# EAGLE design controller (EAGLE 6.5.0)
AUTHOR: Robert Ou; REVISION: 1B

## Sheet 1 of 5
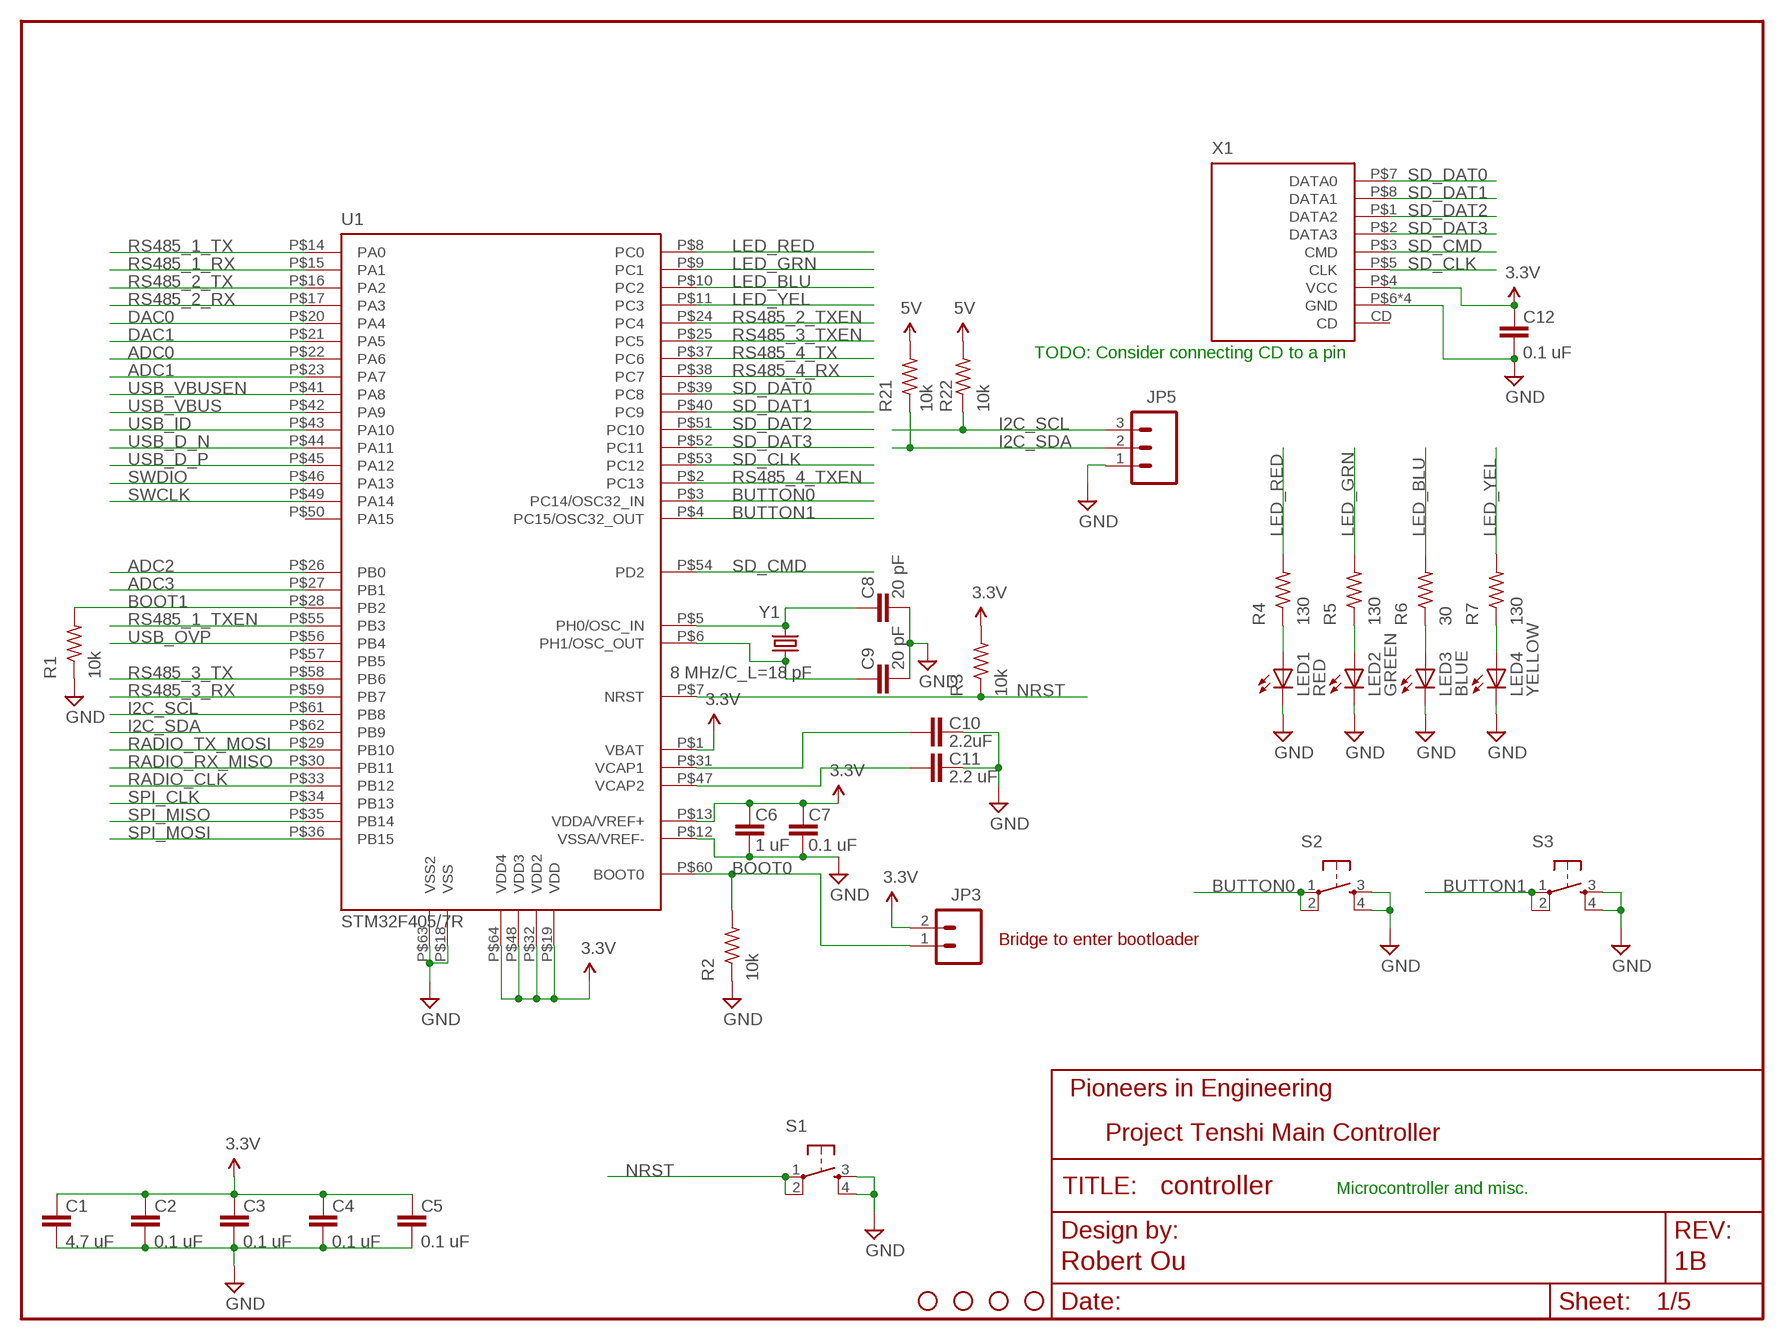
[diagram p0: schematic, sheet 1]

### Parts
C1  4.7 uF  CAP0805  [0805]
C2  0.1 uF  CAP0603-CAP  [0603-CAP]
C3  0.1 uF  CAP0603-CAP  [0603-CAP]
C4  0.1 uF  CAP0603-CAP  [0603-CAP]
C5  0.1 uF  CAP0603-CAP  [0603-CAP]
C6  1 uF  CAP0603-CAP  [0603-CAP]
C7  0.1 uF  CAP0603-CAP  [0603-CAP]
C8  20 pF  CAP0603-CAP  [0603-CAP]
C9  20 pF  CAP0603-CAP  [0603-CAP]
C10  2.2uF  CAP0603-CAP  [0603-CAP]
C11  2.2 uF  CAP0603-CAP  [0603-CAP]
C12  0.1 uF  CAP0603-CAP  [0603-CAP]
JP3  M02PTH  [1X02]
JP5  M031X03-MTA  [1X03-MTA]
LED1  RED  LED0805  [LED-0805]
LED2  GREEN  LED0805  [LED-0805]
LED3  BLUE  LED0805  [LED-0805]
LED4  YELLOW  LED0805  [LED-0805]
R1  10k  R-US_R0603  [R0603]
R2  10k  R-US_R0603  [R0603]
R3  10k  R-US_R0603  [R0603]
R4  130  R-US_R0603  [R0603]
R5  130  R-US_R0603  [R0603]
R6  30  R-US_R0603  [R0603]
R7  130  R-US_R0603  [R0603]
R21  10k  R-US_R0603  [R0603]
R22  10k  R-US_R0603  [R0603]
S1  TAC_SWITCHPTH  [TACTILE-PTH]
S2  TAC_SWITCHPTH  [TACTILE-PTH]
S3  TAC_SWITCHPTH  [TACTILE-PTH]
STANDOFF1  STAND-OFF  [STAND-OFF]
STANDOFF2  STAND-OFF  [STAND-OFF]
STANDOFF3  STAND-OFF  [STAND-OFF]
STANDOFF4  STAND-OFF  [STAND-OFF]
U1  STM32F405/7R  [QFP64]
X1  MICROSD-SOCKETAMPHENOL  [MICROSD-SOCKET]
Y1  8 MHz/C_L=18 pF  CRYSTALSMD  [HC49UP]

### Nets
3.3V: C1.1 C2.1 C3.1 C4.1 C5.1 C6.1 C7.1 C12.1 JP3.2 R3.2 U1.P$1(VBAT) U1.P$13(VDDA/VREF+) U1.P$19(VDD) U1.P$32(VDD2) U1.P$48(VDD3) U1.P$64(VDD4) X1.P$4(VCC) ; also sheet 3,4,5
5V: R21.2 R22.2 ; also sheet 2,3,5
ADC0: U1.P$22(PA6)
ADC1: U1.P$23(PA7)
ADC2: U1.P$26(PB0)
ADC3: U1.P$27(PB1)
BOOT0: JP3.1 R2.2 U1.P$60(BOOT0) ; also sheet 3
BOOT1: R1.2 U1.P$28(PB2)
BUTTON0: S2.1 S2.2 U1.P$3(PC14/OSC32_IN)
BUTTON1: S3.1 S3.2 U1.P$4(PC15/OSC32_OUT)
DAC0: U1.P$20(PA4)
DAC1: U1.P$21(PA5)
GND: C1.2 C2.2 C3.2 C4.2 C5.2 C6.2 C7.2 C8.2 C9.2 C10.2 C11.2 C12.2 JP5.1 LED1.C LED2.C LED3.C LED4.C R1.1 R2.1 S1.3 S1.4 S2.3 S2.4 S3.3 S3.4 U1.P$12(VSSA/VREF-) U1.P$18(VSS) U1.P$63(VSS2) X1.P$6(GND) X1.P$9(GND) X1.P$10(GND) X1.P$11(GND) ; also sheet 2,3,4,5
I2C_SCL: JP5.3 R22.1 U1.P$61(PB8)
I2C_SDA: JP5.2 R21.1 U1.P$62(PB9)
LED_BLU: R6.2 U1.P$10(PC2)
LED_GRN: R5.2 U1.P$9(PC1)
LED_RED: R4.2 U1.P$8(PC0)
LED_YEL: R7.2 U1.P$11(PC3)
N$2: C11.1 U1.P$47(VCAP2)
N$3: C10.1 U1.P$31(VCAP1)
N$4: C9.1 U1.P$6(PH1/OSC_OUT) Y1.1
N$5: LED1.A R4.1
N$6: C8.1 U1.P$5(PH0/OSC_IN) Y1.2
N$7: LED2.A R5.1
N$8: LED3.A R6.1
N$9: LED4.A R7.1
NRST: R3.1 S1.1 S1.2 U1.P$7(NRST) ; also sheet 3
RADIO_CLK: U1.P$33(PB12) ; also sheet 4
RADIO_RX_MISO: U1.P$30(PB11) ; also sheet 4
RADIO_TX_MOSI: U1.P$29(PB10) ; also sheet 4
RS485_1_RX: U1.P$15(PA1) ; also sheet 2
RS485_1_TX: U1.P$14(PA0) ; also sheet 2
RS485_1_TXEN: U1.P$55(PB3) ; also sheet 2
RS485_2_RX: U1.P$17(PA3) ; also sheet 2
RS485_2_TX: U1.P$16(PA2) ; also sheet 2
RS485_2_TXEN: U1.P$24(PC4) ; also sheet 2
RS485_3_RX: U1.P$59(PB7) ; also sheet 2
RS485_3_TX: U1.P$58(PB6) ; also sheet 2
RS485_3_TXEN: U1.P$25(PC5) ; also sheet 2
RS485_4_RX: U1.P$38(PC7) ; also sheet 2
RS485_4_TX: U1.P$37(PC6) ; also sheet 2
RS485_4_TXEN: U1.P$2(PC13) ; also sheet 2
SD_CLK: U1.P$53(PC12) X1.P$5(CLK)
SD_CMD: U1.P$54(PD2) X1.P$3(CMD)
SD_DAT0: U1.P$39(PC8) X1.P$7(DATA0)
SD_DAT1: U1.P$40(PC9) X1.P$8(DATA1)
SD_DAT2: U1.P$51(PC10) X1.P$1(DATA2)
SD_DAT3: U1.P$52(PC11) X1.P$2(DATA3)
SPI_CLK: U1.P$34(PB13)
SPI_MISO: U1.P$35(PB14)
SPI_MOSI: U1.P$36(PB15)
SWCLK: U1.P$49(PA14) ; also sheet 3
SWDIO: U1.P$46(PA13) ; also sheet 3
USB_D_N: U1.P$44(PA11) ; also sheet 3
USB_D_P: U1.P$45(PA12) ; also sheet 3
USB_ID: U1.P$43(PA10) ; also sheet 3
USB_OVP: U1.P$56(PB4) ; also sheet 3
USB_VBUS: U1.P$42(PA9) ; also sheet 3
USB_VBUSEN: U1.P$41(PA8) ; also sheet 3
Unconnected: U1.P$50(PA15) U1.P$57(PB5) X1.CD

### Notes on the sheet
- TODO: Consider connecting CD to a pin
- Bridge to enter bootloader
- Project Tenshi Main Controller
- Microcontroller and misc.

## Sheet 2 of 5
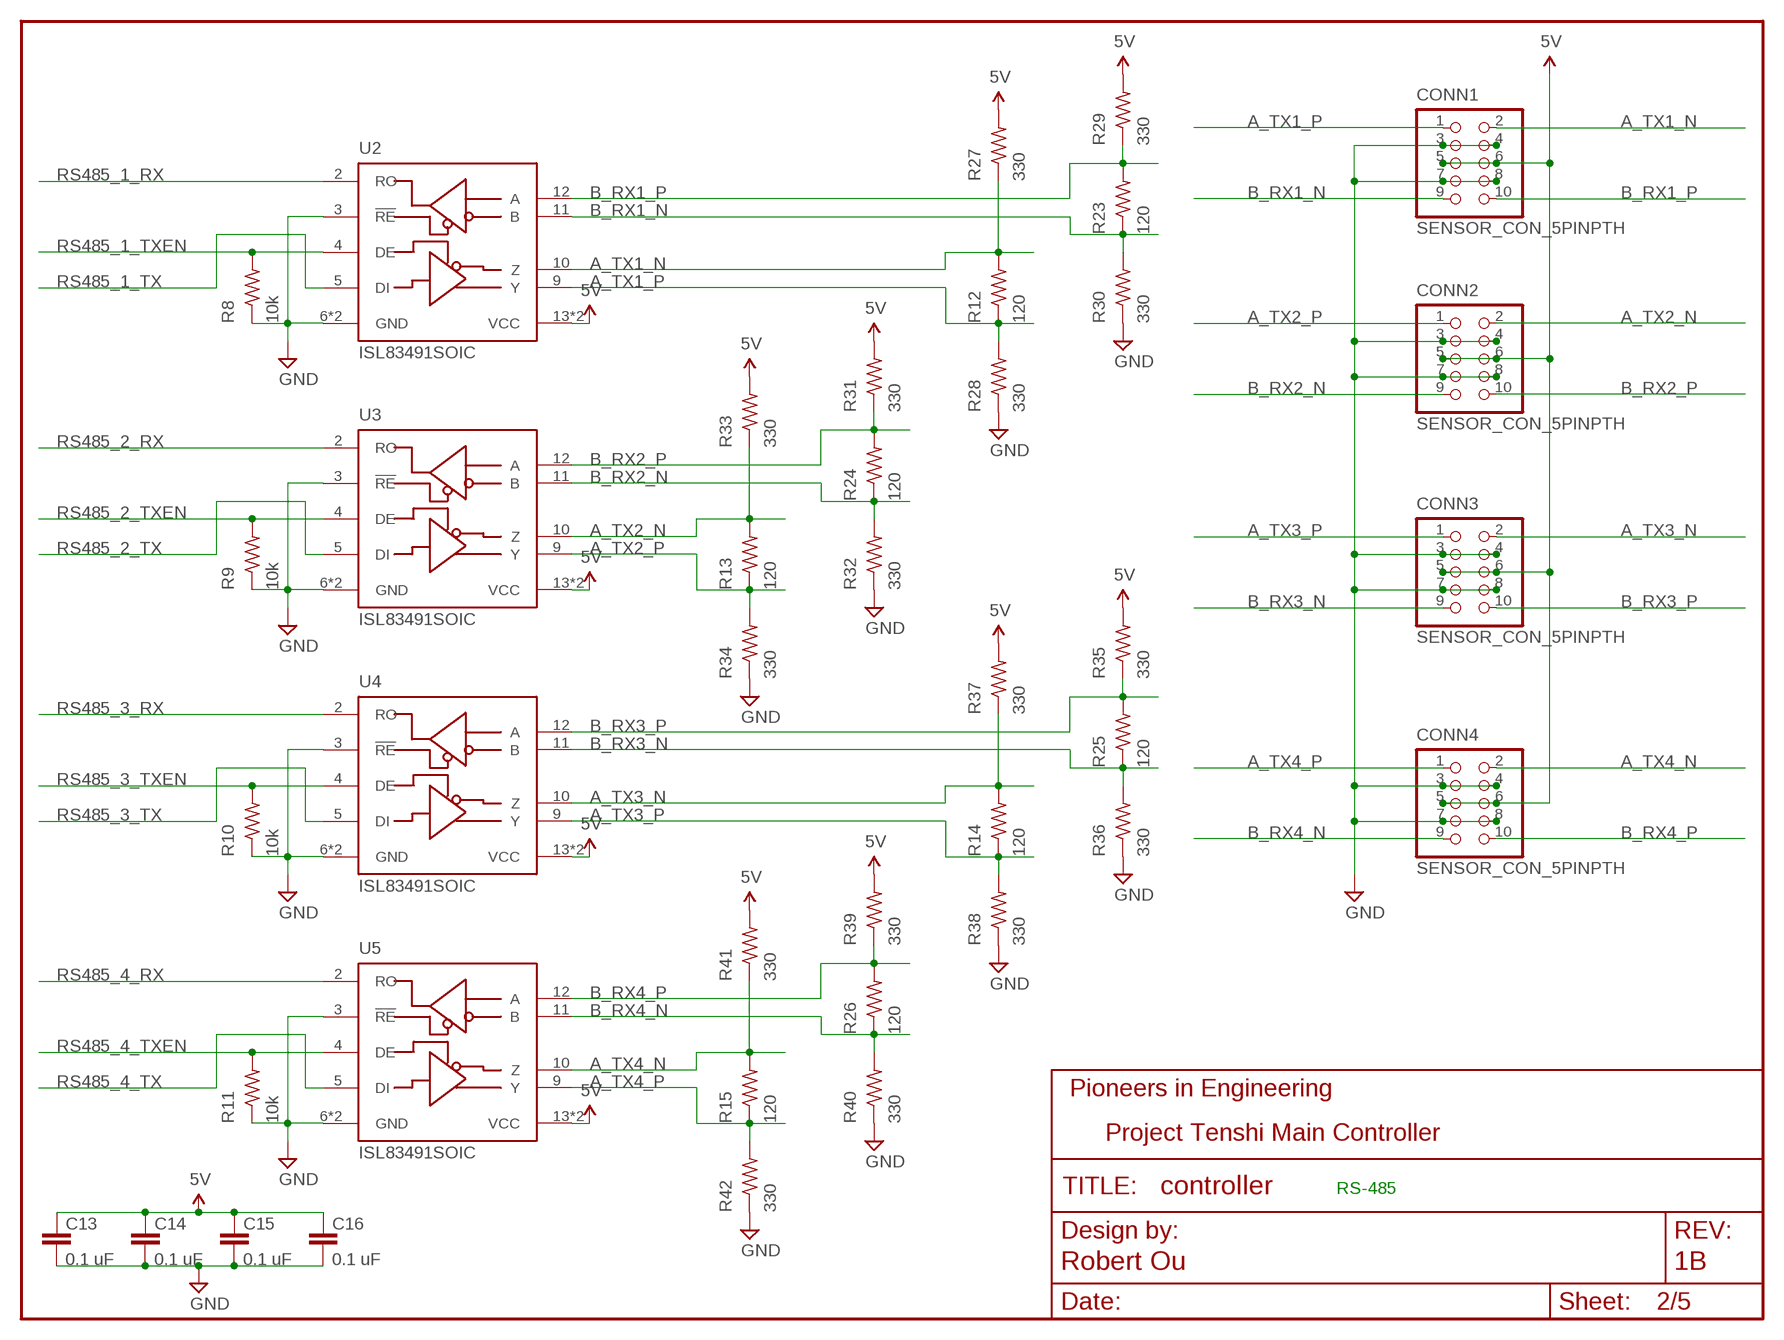
[diagram p1: schematic, sheet 2]

### Parts
C13  0.1 uF  CAP0603-CAP  [0603-CAP]
C14  0.1 uF  CAP0603-CAP  [0603-CAP]
C15  0.1 uF  CAP0603-CAP  [0603-CAP]
C16  0.1 uF  CAP0603-CAP  [0603-CAP]
CONN1  SENSOR_CON_5PINPTH  SENSOR_CON_5PINPTH-SHROUDED  [2X5_SHROUDED]
CONN2  SENSOR_CON_5PINPTH  SENSOR_CON_5PINPTH-SHROUDED  [2X5_SHROUDED]
CONN3  SENSOR_CON_5PINPTH  SENSOR_CON_5PINPTH-SHROUDED  [2X5_SHROUDED]
CONN4  SENSOR_CON_5PINPTH  SENSOR_CON_5PINPTH-SHROUDED  [2X5_SHROUDED]
R8  10k  R-US_R0603  [R0603]
R9  10k  R-US_R0603  [R0603]
R10  10k  R-US_R0603  [R0603]
R11  10k  R-US_R0603  [R0603]
R12  120  R-US_R0603  [R0603]
R13  120  R-US_R0603  [R0603]
R14  120  R-US_R0603  [R0603]
R15  120  R-US_R0603  [R0603]
R23  120  R-US_R0603  [R0603]
R24  120  R-US_R0603  [R0603]
R25  120  R-US_R0603  [R0603]
R26  120  R-US_R0603  [R0603]
R27  330  R-US_R0603  [R0603]
R28  330  R-US_R0603  [R0603]
R29  330  R-US_R0603  [R0603]
R30  330  R-US_R0603  [R0603]
R31  330  R-US_R0603  [R0603]
R32  330  R-US_R0603  [R0603]
R33  330  R-US_R0603  [R0603]
R34  330  R-US_R0603  [R0603]
R35  330  R-US_R0603  [R0603]
R36  330  R-US_R0603  [R0603]
R37  330  R-US_R0603  [R0603]
R38  330  R-US_R0603  [R0603]
R39  330  R-US_R0603  [R0603]
R40  330  R-US_R0603  [R0603]
R41  330  R-US_R0603  [R0603]
R42  330  R-US_R0603  [R0603]
U2  ISL83491SOIC  [SOIC14]
U3  ISL83491SOIC  [SOIC14]
U4  ISL83491SOIC  [SOIC14]
U5  ISL83491SOIC  [SOIC14]

### Nets
5V: C13.1 C14.1 C15.1 C16.1 CONN1.5 CONN1.6 CONN2.5 CONN2.6 CONN3.5 CONN3.6 CONN4.5 CONN4.6 R27.2 R29.2 R31.2 R33.2 R35.2 R37.2 R39.2 R41.2 U2.13(VCC) U2.14(VCC) U3.13(VCC) U3.14(VCC) U4.13(VCC) U4.14(VCC) U5.13(VCC) U5.14(VCC) ; also sheet 1,3,5
A_TX1_N: CONN1.2 R12.2 R27.1 U2.10(Z)
A_TX1_P: CONN1.1 R12.1 R28.2 U2.9(Y)
A_TX2_N: CONN2.2 R13.2 R33.1 U3.10(Z)
A_TX2_P: CONN2.1 R13.1 R34.2 U3.9(Y)
A_TX3_N: CONN3.2 R14.2 R37.1 U4.10(Z)
A_TX3_P: CONN3.1 R14.1 R38.2 U4.9(Y)
A_TX4_N: CONN4.2 R15.2 R41.1 U5.10(Z)
A_TX4_P: CONN4.1 R15.1 R42.2 U5.9(Y)
B_RX1_N: CONN1.9 R23.1 R30.2 U2.11(B)
B_RX1_P: CONN1.10 R23.2 R29.1 U2.12(A)
B_RX2_N: CONN2.9 R24.1 R32.2 U3.11(B)
B_RX2_P: CONN2.10 R24.2 R31.1 U3.12(A)
B_RX3_N: CONN3.9 R25.1 R36.2 U4.11(B)
B_RX3_P: CONN3.10 R25.2 R35.1 U4.12(A)
B_RX4_N: CONN4.9 R26.1 R40.2 U5.11(B)
B_RX4_P: CONN4.10 R26.2 R39.1 U5.12(A)
GND: C13.2 C14.2 C15.2 C16.2 CONN1.3 CONN1.4 CONN1.7 CONN1.8 CONN2.3 CONN2.4 CONN2.7 CONN2.8 CONN3.3 CONN3.4 CONN3.7 CONN3.8 CONN4.3 CONN4.4 CONN4.7 CONN4.8 R8.1 R9.1 R10.1 R11.1 R28.1 R30.1 R32.1 R34.1 R36.1 R38.1 R40.1 R42.1 U2.3(!RE) U2.6(GND) U2.7(GND) U3.3(!RE) U3.6(GND) U3.7(GND) U4.3(!RE) U4.6(GND) U4.7(GND) U5.3(!RE) U5.6(GND) U5.7(GND) ; also sheet 1,3,4,5
RS485_1_RX: U2.2(RO) ; also sheet 1
RS485_1_TX: U2.5(DI) ; also sheet 1
RS485_1_TXEN: R8.2 U2.4(DE) ; also sheet 1
RS485_2_RX: U3.2(RO) ; also sheet 1
RS485_2_TX: U3.5(DI) ; also sheet 1
RS485_2_TXEN: R9.2 U3.4(DE) ; also sheet 1
RS485_3_RX: U4.2(RO) ; also sheet 1
RS485_3_TX: U4.5(DI) ; also sheet 1
RS485_3_TXEN: R10.2 U4.4(DE) ; also sheet 1
RS485_4_RX: U5.2(RO) ; also sheet 1
RS485_4_TX: U5.5(DI) ; also sheet 1
RS485_4_TXEN: R11.2 U5.4(DE) ; also sheet 1

### Notes on the sheet
- Project Tenshi Main Controller
- RS-485

## Sheet 3 of 5
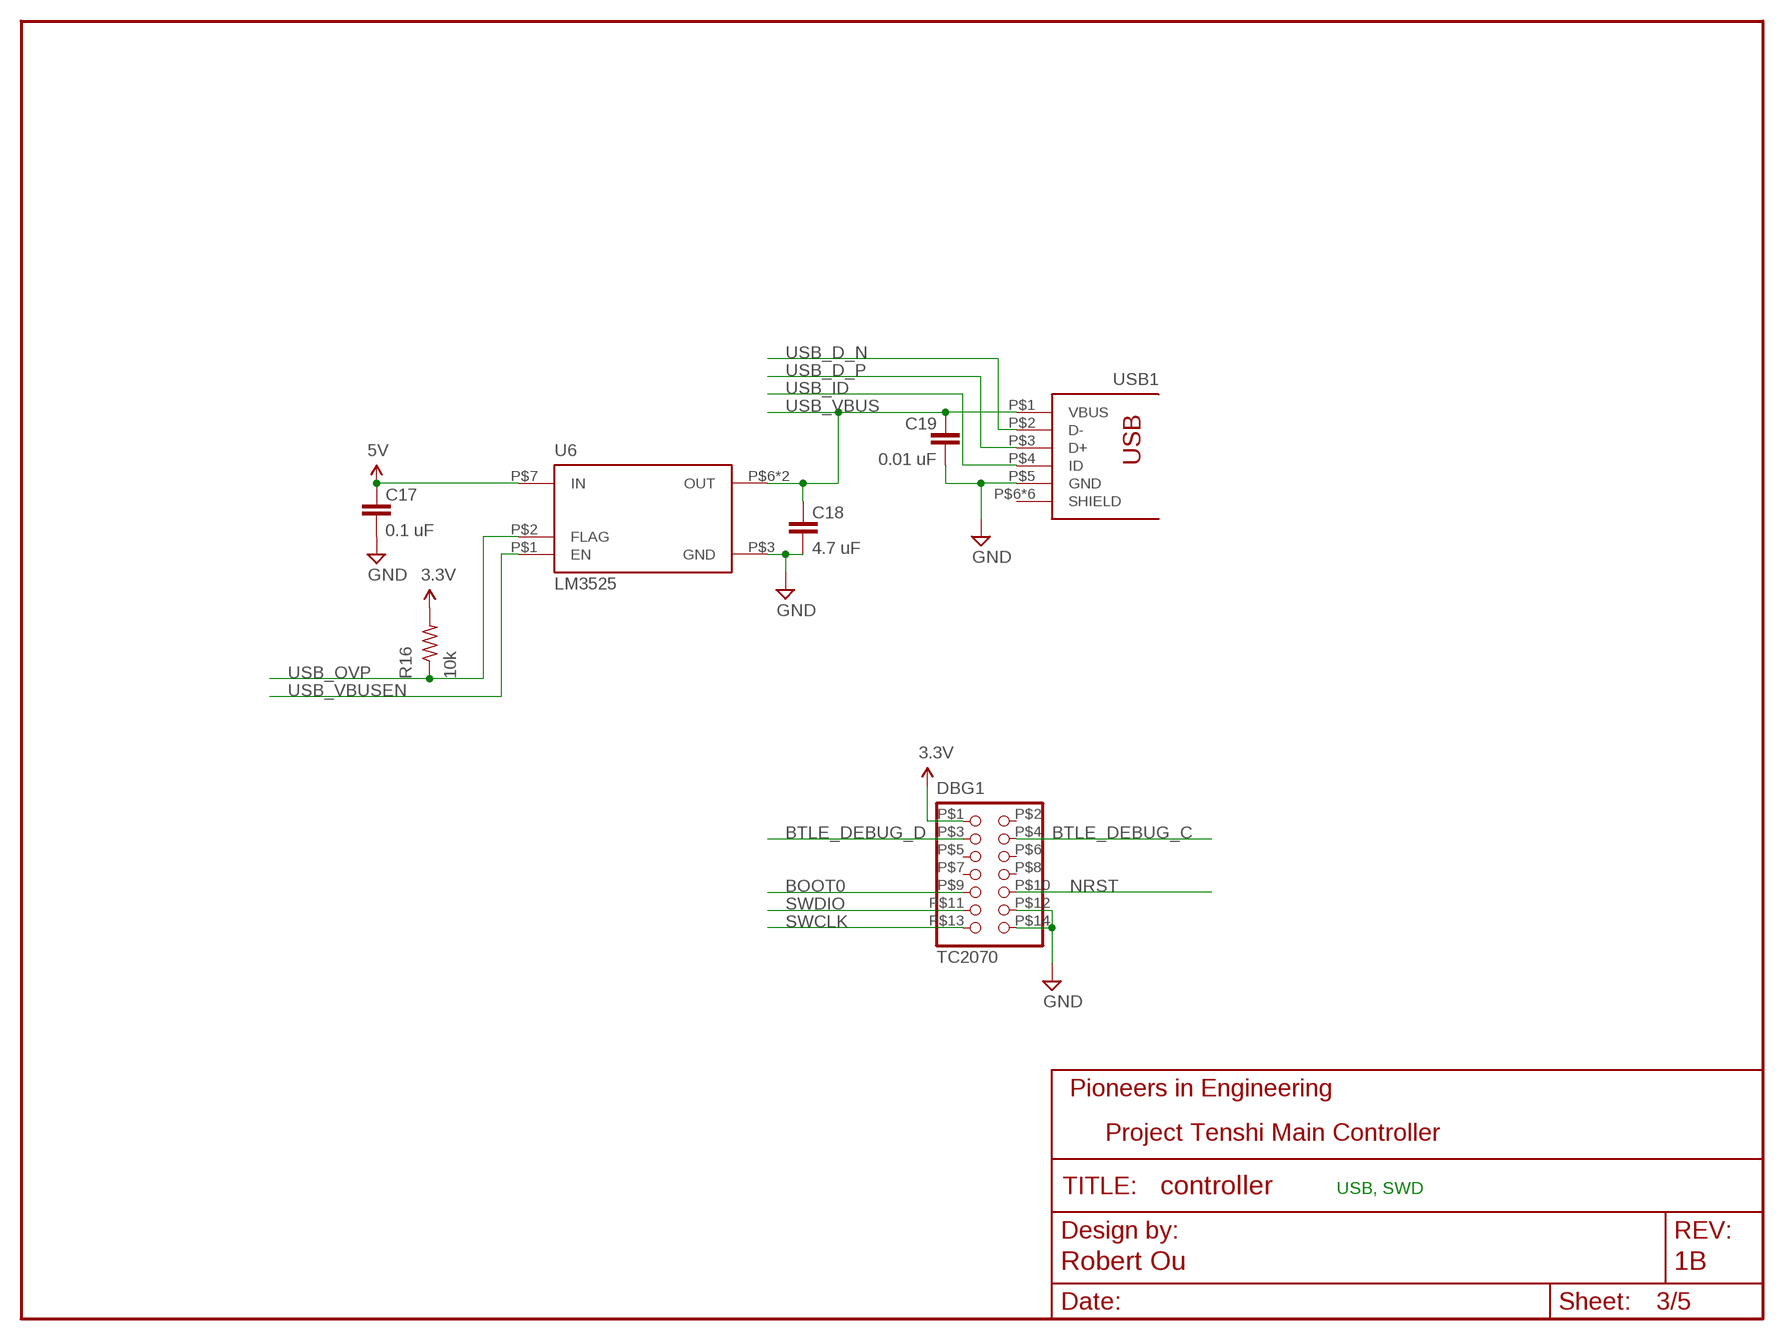
[diagram p2: schematic, sheet 3]

### Parts
C17  0.1 uF  CAP0603-CAP  [0603-CAP]
C18  4.7 uF  CAP0805  [0805]
C19  0.01 uF  CAP0603-CAP  [0603-CAP]
DBG1  TC2070  [TC2070]
R16  10k  R-US_R0603  [R0603]
U6  LM3525  [SOIC8]
USB1  USB-OTGMICRO-AB  [USB-MICRO-AB]

### Nets
3.3V: DBG1.P$1 R16.2 ; also sheet 1,4,5
5V: C17.1 U6.P$7(IN) ; also sheet 1,2,5
BOOT0: DBG1.P$9 ; also sheet 1
BTLE_DEBUG_C: DBG1.P$4 ; also sheet 4
BTLE_DEBUG_D: DBG1.P$3 ; also sheet 4
GND: C17.2 C18.2 C19.2 DBG1.P$12 DBG1.P$14 U6.P$3(GND) USB1.P$5(GND) ; also sheet 1,2,4,5
NRST: DBG1.P$10 ; also sheet 1
SWCLK: DBG1.P$13 ; also sheet 1
SWDIO: DBG1.P$11 ; also sheet 1
USB_D_N: USB1.P$2(D-) ; also sheet 1
USB_D_P: USB1.P$3(D+) ; also sheet 1
USB_ID: USB1.P$4(ID) ; also sheet 1
USB_OVP: R16.1 U6.P$2(FLAG) ; also sheet 1
USB_VBUS: C18.1 C19.1 U6.P$6(OUT) U6.P$8(OUT) USB1.P$1(VBUS) ; also sheet 1
USB_VBUSEN: U6.P$1(EN) ; also sheet 1
Unconnected: DBG1.P$2 DBG1.P$5 DBG1.P$6 DBG1.P$7 DBG1.P$8 USB1.P$6(SHIELD) USB1.P$7(SHIELD) USB1.P$8(SHIELD) USB1.P$9(SHIELD) USB1.P$10(SHIELD) USB1.P$11(SHIELD)

### Notes on the sheet
- Project Tenshi Main Controller
- USB, SWD

## Sheet 4 of 5
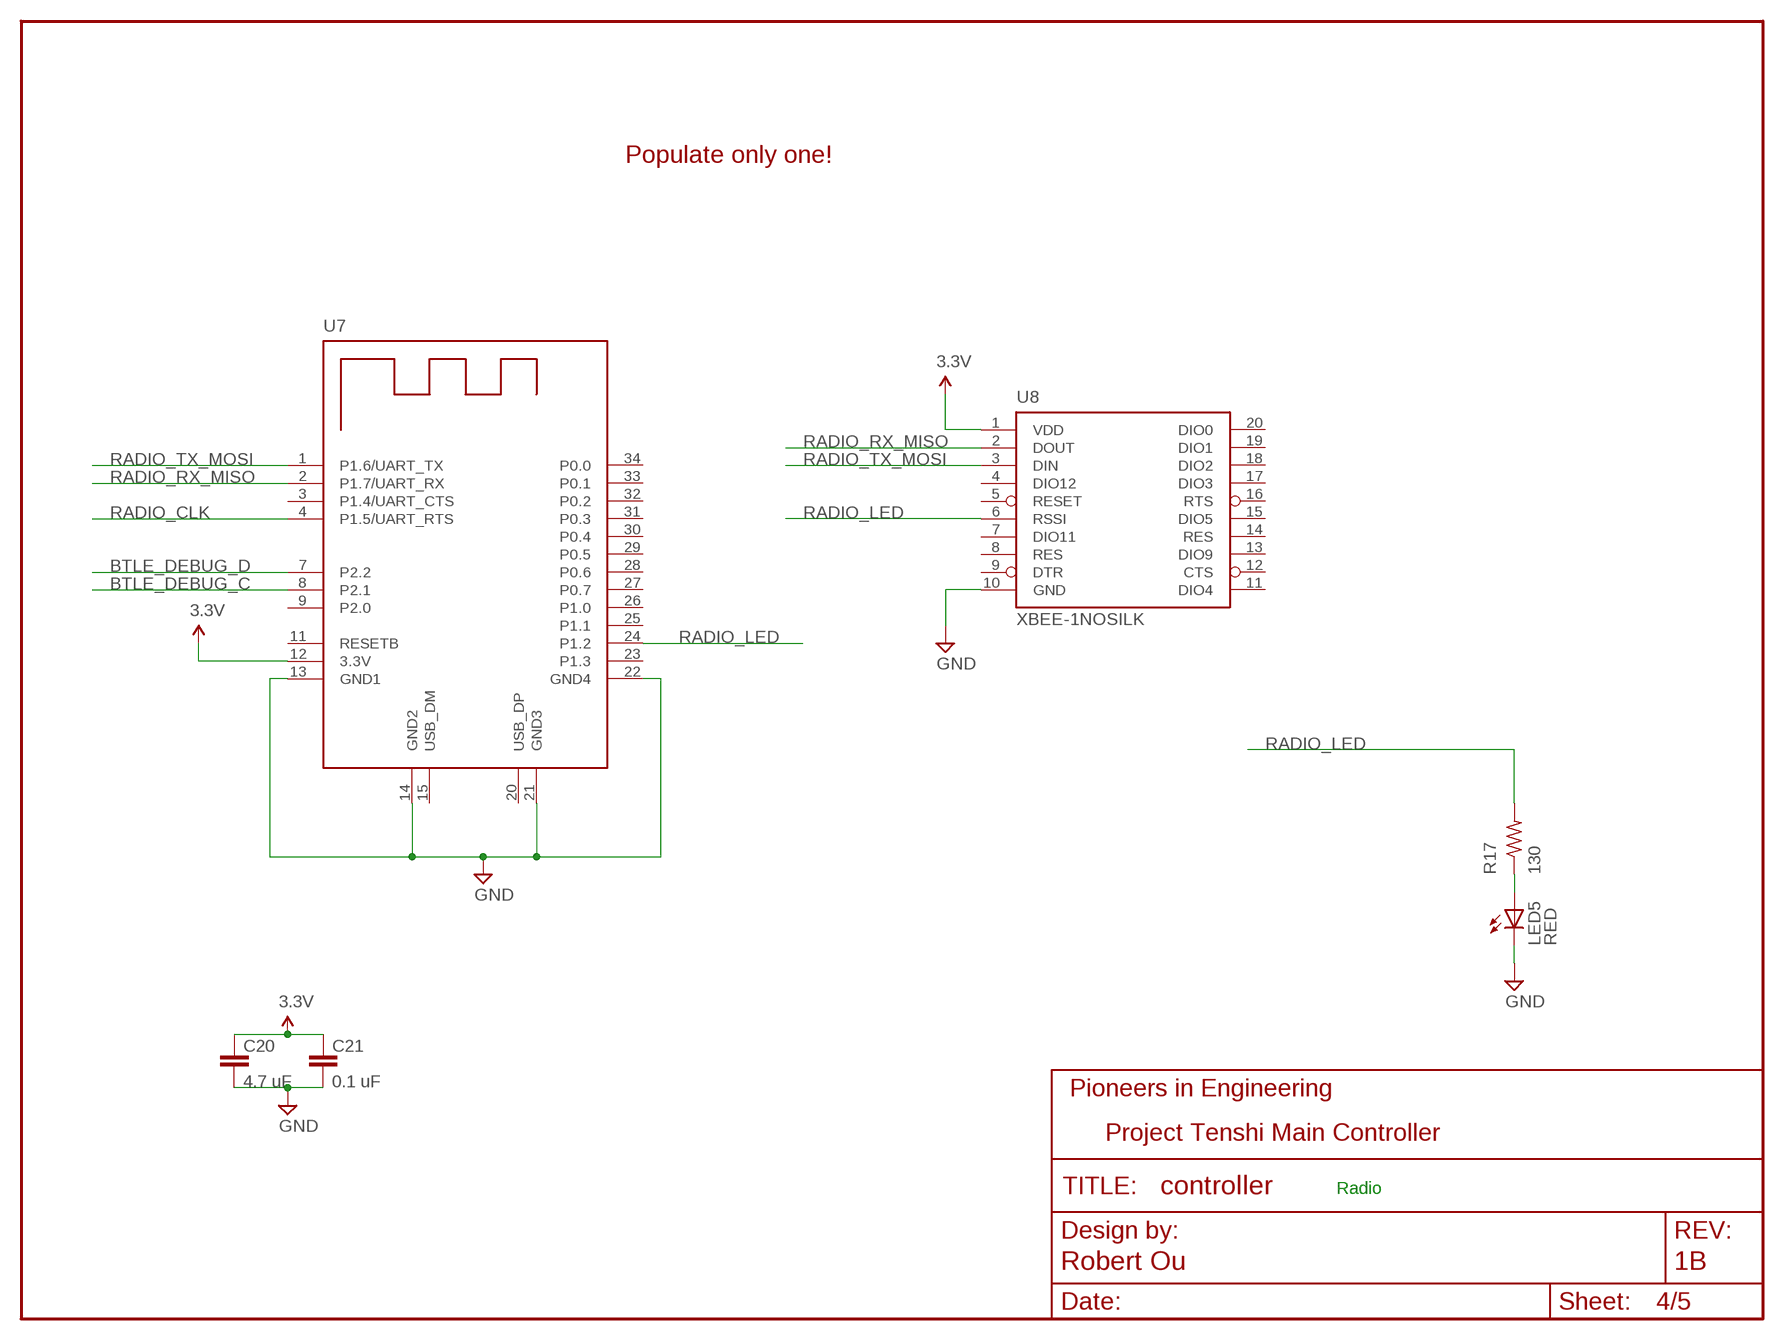
[diagram p3: schematic, sheet 4]

### Parts
C20  4.7 uF  CAP0805  [0805]
C21  0.1 uF  CAP0603-CAP  [0603-CAP]
LED5  RED  LED0805  [LED-0805]
R17  130  R-US_R0603  [R0603]
U7  BLE-HM-10  [BLE-HM-10]
U8  XBEE-1NOSILK  [XBEE-NOSILK]

### Nets
3.3V: C20.1 C21.1 U7.12(3.3V) U8.1(VDD) ; also sheet 1,3,5
BTLE_DEBUG_C: U7.8(P2.1) ; also sheet 3
BTLE_DEBUG_D: U7.7(P2.2) ; also sheet 3
GND: C20.2 C21.2 LED5.C U7.13(GND1) U7.14(GND2) U7.21(GND3) U7.22(GND4) U8.10(GND) ; also sheet 1,2,3,5
N$10: LED5.A R17.1
RADIO_CLK: U7.4(P1.5/UART_RTS) ; also sheet 1
RADIO_LED: R17.2 U7.24(P1.2) U8.6(RSSI)
RADIO_RX_MISO: U7.2(P1.7/UART_RX) U8.2(DOUT) ; also sheet 1
RADIO_TX_MOSI: U7.1(P1.6/UART_TX) U8.3(DIN) ; also sheet 1
Unconnected: U7.3(P1.4/UART_CTS) U7.9(P2.0) U7.11(RESETB) U7.15(USB_DM) U7.20(USB_DP) U7.23(P1.3) U7.25(P1.1) U7.26(P1.0) U7.27(P0.7) U7.28(P0.6) U7.29(P0.5) U7.30(P0.4) U7.31(P0.3) U7.32(P0.2) U7.33(P0.1) U7.34(P0.0) U8.4(DIO12) U8.5(RESET) U8.7(DIO11) U8.8(RES) U8.9(DTR) U8.11(DIO4) U8.12(CTS) U8.13(DIO9) U8.14(RES) U8.15(DIO5) U8.16(RTS) U8.17(DIO3) U8.18(DIO2) U8.19(DIO1) U8.20(DIO0)

### Notes on the sheet
- Populate only one!
- Project Tenshi Main Controller
- Radio

## Sheet 5 of 5
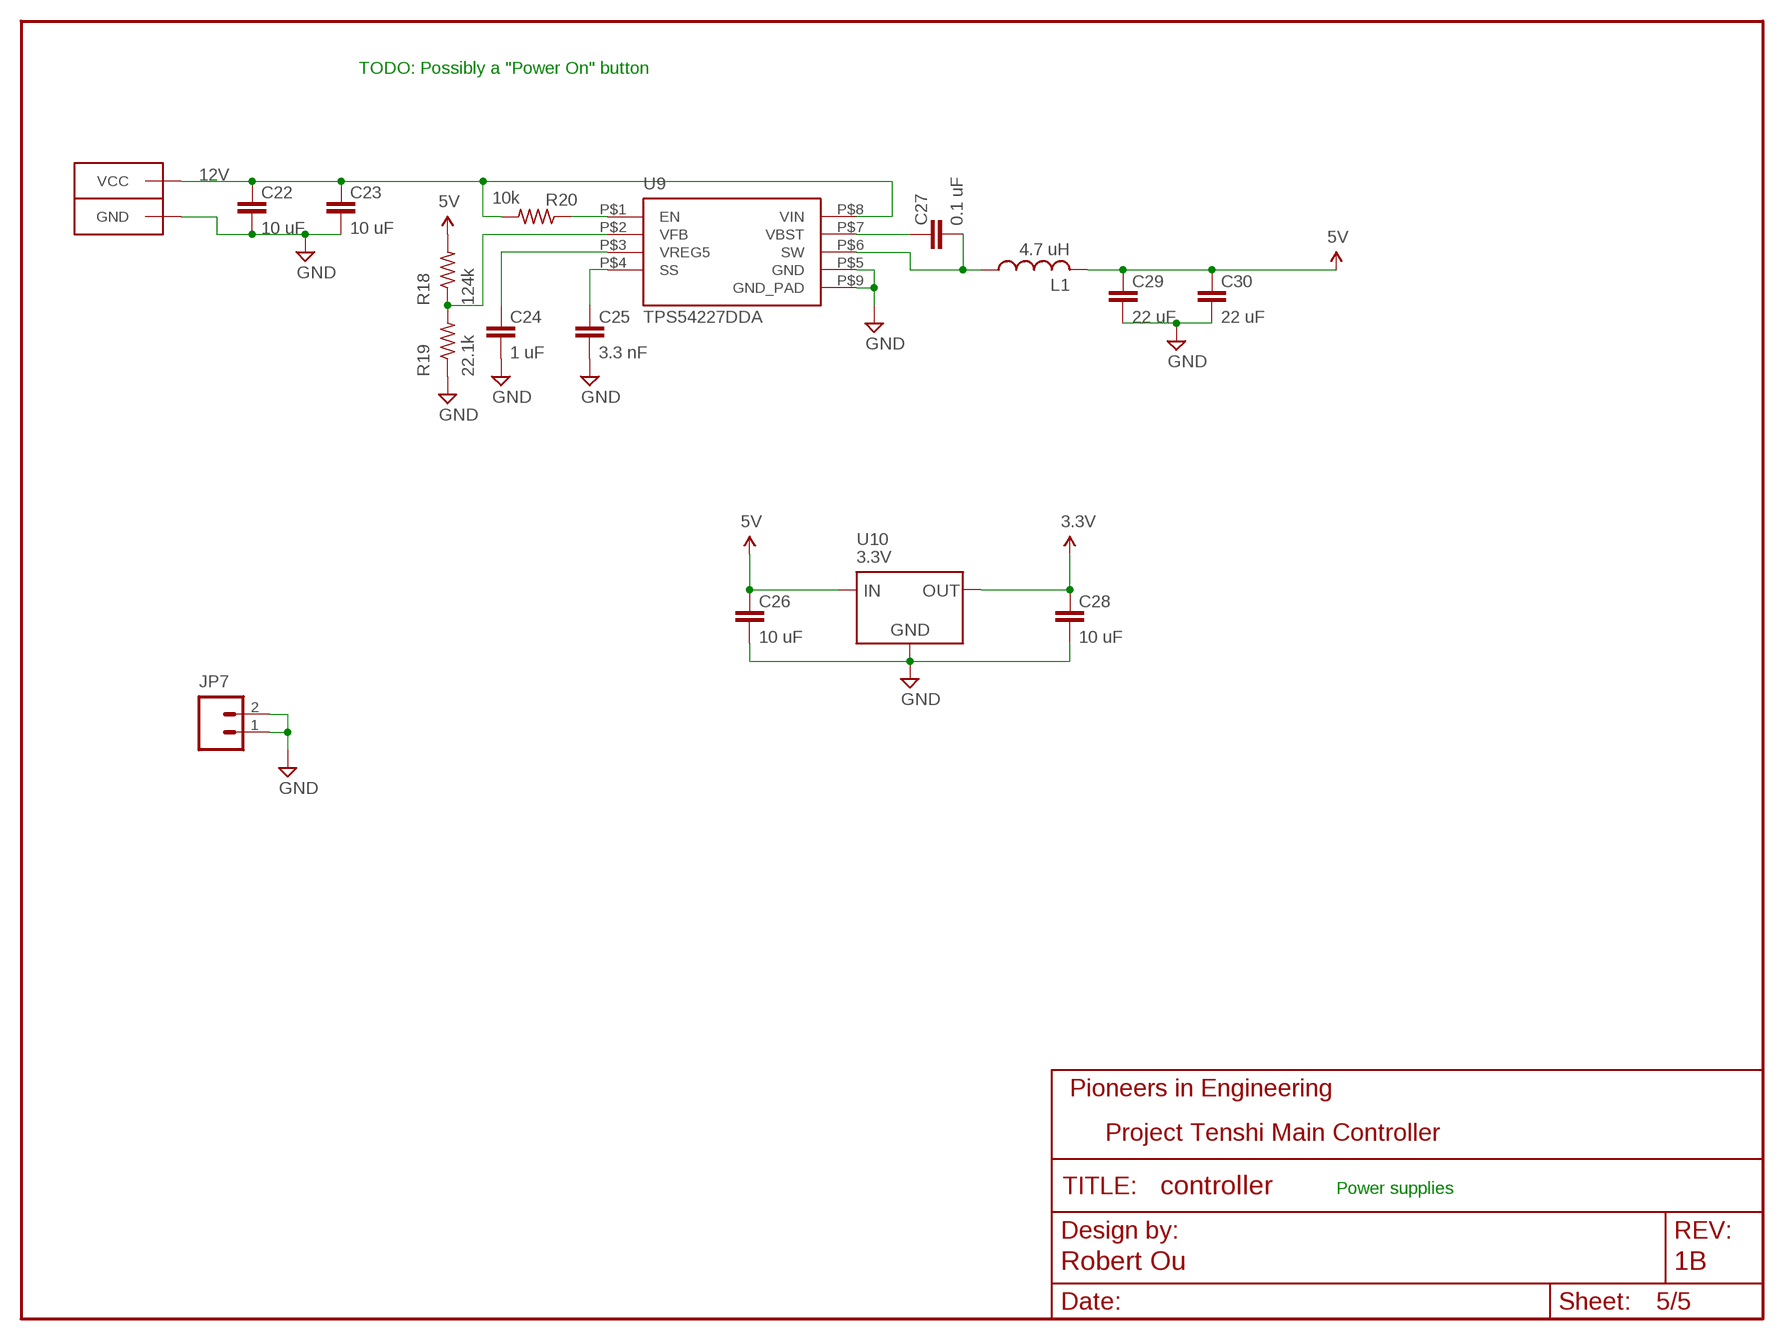
[diagram p4: schematic, sheet 5]

### Parts
C22  10 uF  CAP1206  [1206]
C23  10 uF  CAP1206  [1206]
C24  1 uF  CAP0603-CAP  [0603-CAP]
C25  3.3 nF  CAP0603-CAP  [0603-CAP]
C26  10 uF  CAP1206  [1206]
C27  0.1 uF  CAP0603-CAP  [0603-CAP]
C28  10 uF  CAP1206  [1206]
C29  22 uF  CAP1206  [1206]
C30  22 uF  CAP1206  [1206]
CONN5  ANDERSONHORIZONTAL  [ANDERSON_HORIZONTAL]
JP7  M02PTH  [1X02]
L1  4.7 uH  INDUCTOR6MM  [INDUCTOR-6MM]
R18  124k  R-US_R0603  [R0603]
R19  22.1k  R-US_R0603  [R0603]
R20  10k  R-US_R0603  [R0603]
U9  TPS54227DDA  [DDA]
U10  3.3V  LM1117  [SOT223]

### Nets
3.3V: C28.1 U10.P$2(OUT) U10.P$4(OUT) ; also sheet 1,3,4
5V: C26.1 C29.1 C30.1 L1.P$2 R18.2 U10.P$3(IN) ; also sheet 1,2,3
12V: C22.1 C23.1 CONN5.PIN2(VCC) R20.2 U9.P$8(VIN)
GND: C22.2 C23.2 C24.2 C25.2 C26.2 C28.2 C29.2 C30.2 CONN5.PIN1(GND) JP7.1 JP7.2 R19.1 U9.P$5(GND) U9.P$9(GND_PAD) U10.P$1(GND) ; also sheet 1,2,3,4
N$12: C27.1 U9.P$7(VBST)
N$13: C25.1 U9.P$4(SS)
N$14: C24.1 U9.P$3(VREG5)
N$15: R18.1 R19.2 U9.P$2(VFB)
N$16: R20.1 U9.P$1(EN)
N$17: C27.2 L1.P$1 U9.P$6(SW)

### Notes on the sheet
- TODO: Possibly a "Power On" button
- Project Tenshi Main Controller
- Power supplies

## Library data of the parts
C1-C30 = pie:CAP: Capacitor Standard 0603 ceramic capacitor, and 0.1" leaded capacitor.; PIE-INT-REF-NUM: CAPACITOR-GENERIC
CONN1-CONN4 = pie:SENSOR_CON_5PIN
CONN5 = pie:ANDERSON: 2-pin 25A Anderson Connector http://www.alliedelec.com/images/products/datasheets/bm/ANDERSON_POWER_PRODUCTS/70162018.pdf; PIE-INT-REF-NUM: Anderson
DBG1 = pie:TC2070; PIE-INT-REF-NUM: DNL
JP3 JP7 = pie:M02: 2-pin 0.1-inch header and MTA connector; PIE-INT-REF-NUM: BULK-STOCK
JP5 = pie:M03: 3-pin 0.1-inch header and MTA connector; PIE-INT-REF-NUM: MTA
L1 = pie:INDUCTOR: Inductor Standard inductor, American symbol; PIE-INT-REF-NUM: NR6028T4R7M
LED1-LED5 = pie:LED: LEDs Standard schematic elements and footprints for 5mm, 3mm, 1206, and 0603 sized LEDs. 5mm - Spark Fun Electronics SKU : COM-00529 (and others); PIE-INT-REF-NUM: LED
R1-R42 = pie:R-US_: RESISTOR, American symbol; PIE-INT-REF-NUM: RESISTOR-GENERIC
S1-S3 = pie:TAC_SWITCH: Momentary Switch Button commonly used for reset or general input. Spark Fun Electronics SKU : COM-00097; PIE-INT-REF-NUM: pth_pushbutton
STANDOFF1-STANDOFF4 = pie:STAND-OFF: #4 Stand Off This is the mechanical footprint for a #4 phillips button head screw. Use the keepout ring to avoid running the screw head into surrounding components. SKU : PRT-00447; PIE-INT-REF-NUM: DNL
U1 = pie:STM32F405/7R: STM32F405/407 - 64 pin; PIE-INT-REF-NUM: stm32f405
U2-U5 = pie:ISL83491; PIE-INT-REF-NUM: rs485_491
U6 = pie:LM3525: LM3525 Single Port USB Power Switch and Over-Current Protection; PIE-INT-REF-NUM: lm3525
U7 = pie:BLE-HM-10: HM-10 module CC2540-based BTLE module; PIE-INT-REF-NUM: hm10
U8 = pie:XBEE-1: XBee Header; PIE-INT-REF-NUM: xbee
U9 = pie:TPS54227: TPS54227 4.5V to 18V Input, 2-A SYNCHRONOUS STEP DOWN CONVERTER; PIE-INT-REF-NUM: tps54227
U10 = pie:LM1117; PIE-INT-REF-NUM: lm1117
USB1 = pie:USB-OTG: USB Connector OTG connector with ID pin; PIE-INT-REF-NUM: USB
X1 = pie:MICROSD-SOCKET: μSD socket Socket for a MicroSD/TransFlash card; PIE-INT-REF-NUM: uSD
Y1 = pie:CRYSTAL: Various standard crystals. Proven footprints. Spark Fun Electronics SKU : COM-00534; PIE-INT-REF-NUM: CRYSTAL

## Board
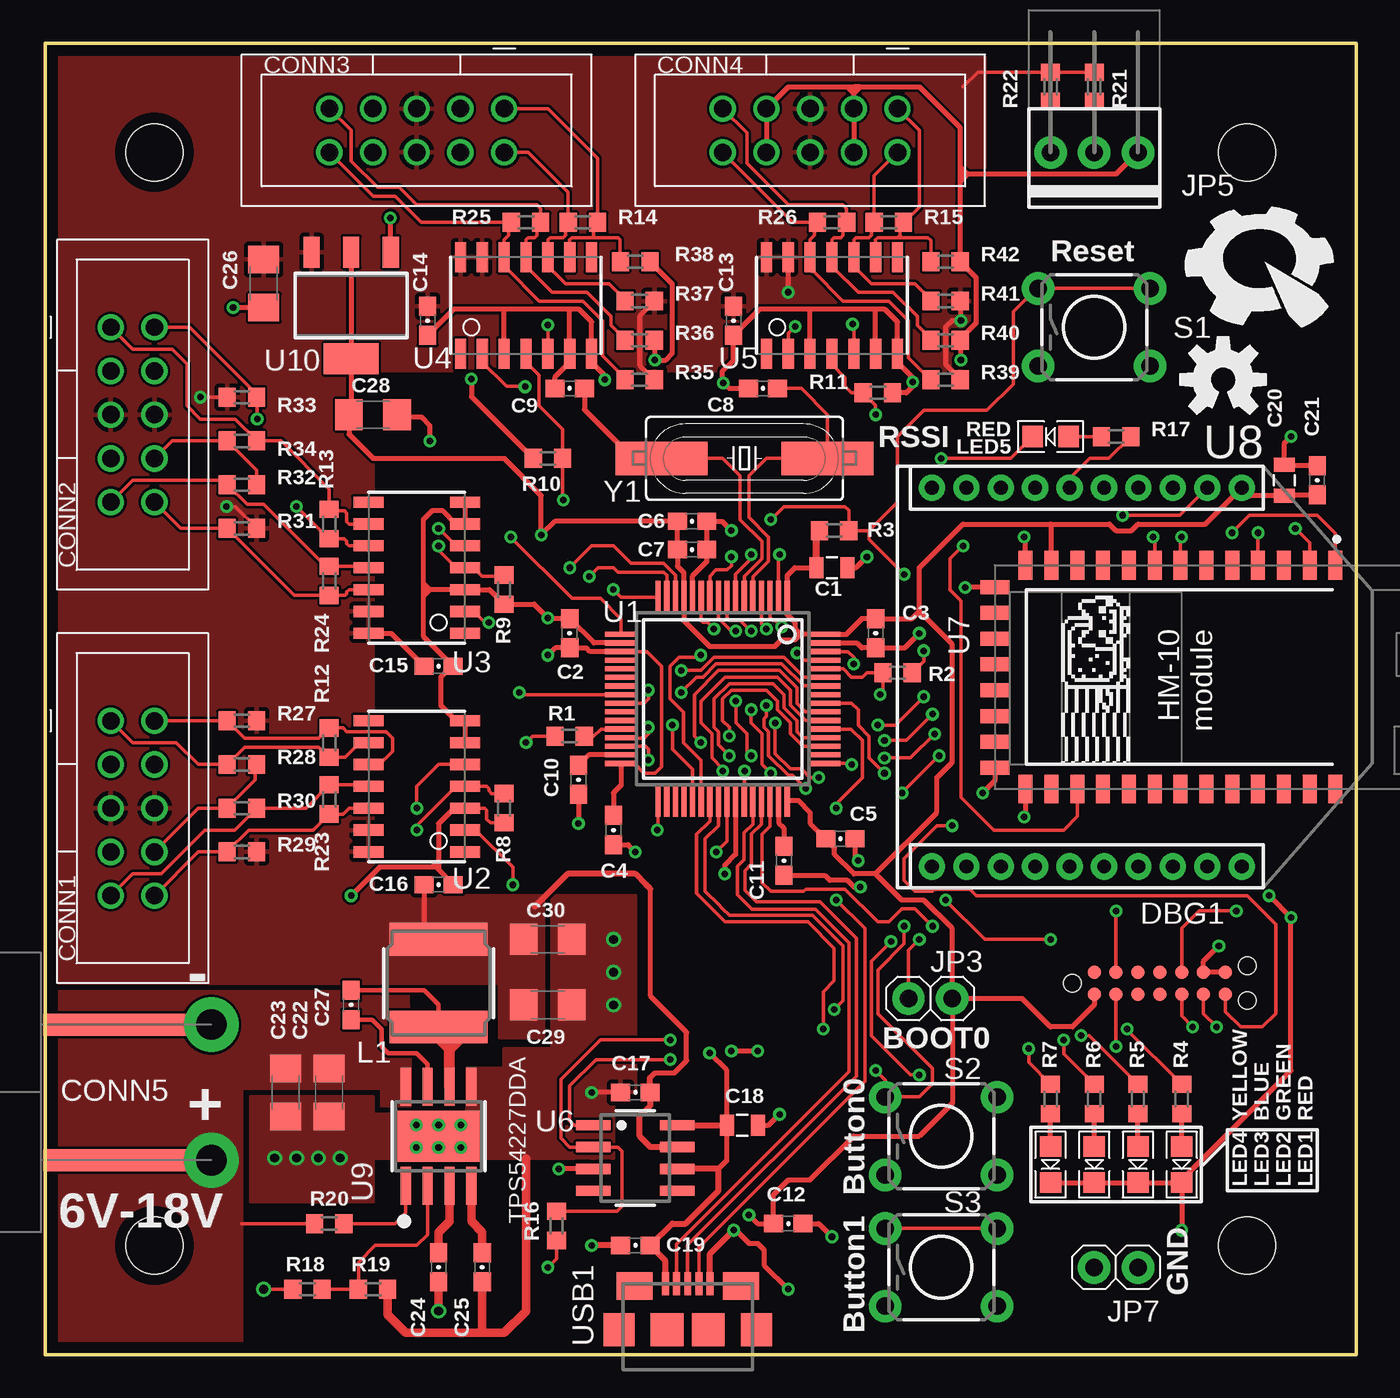
[diagram p5: board, top side]
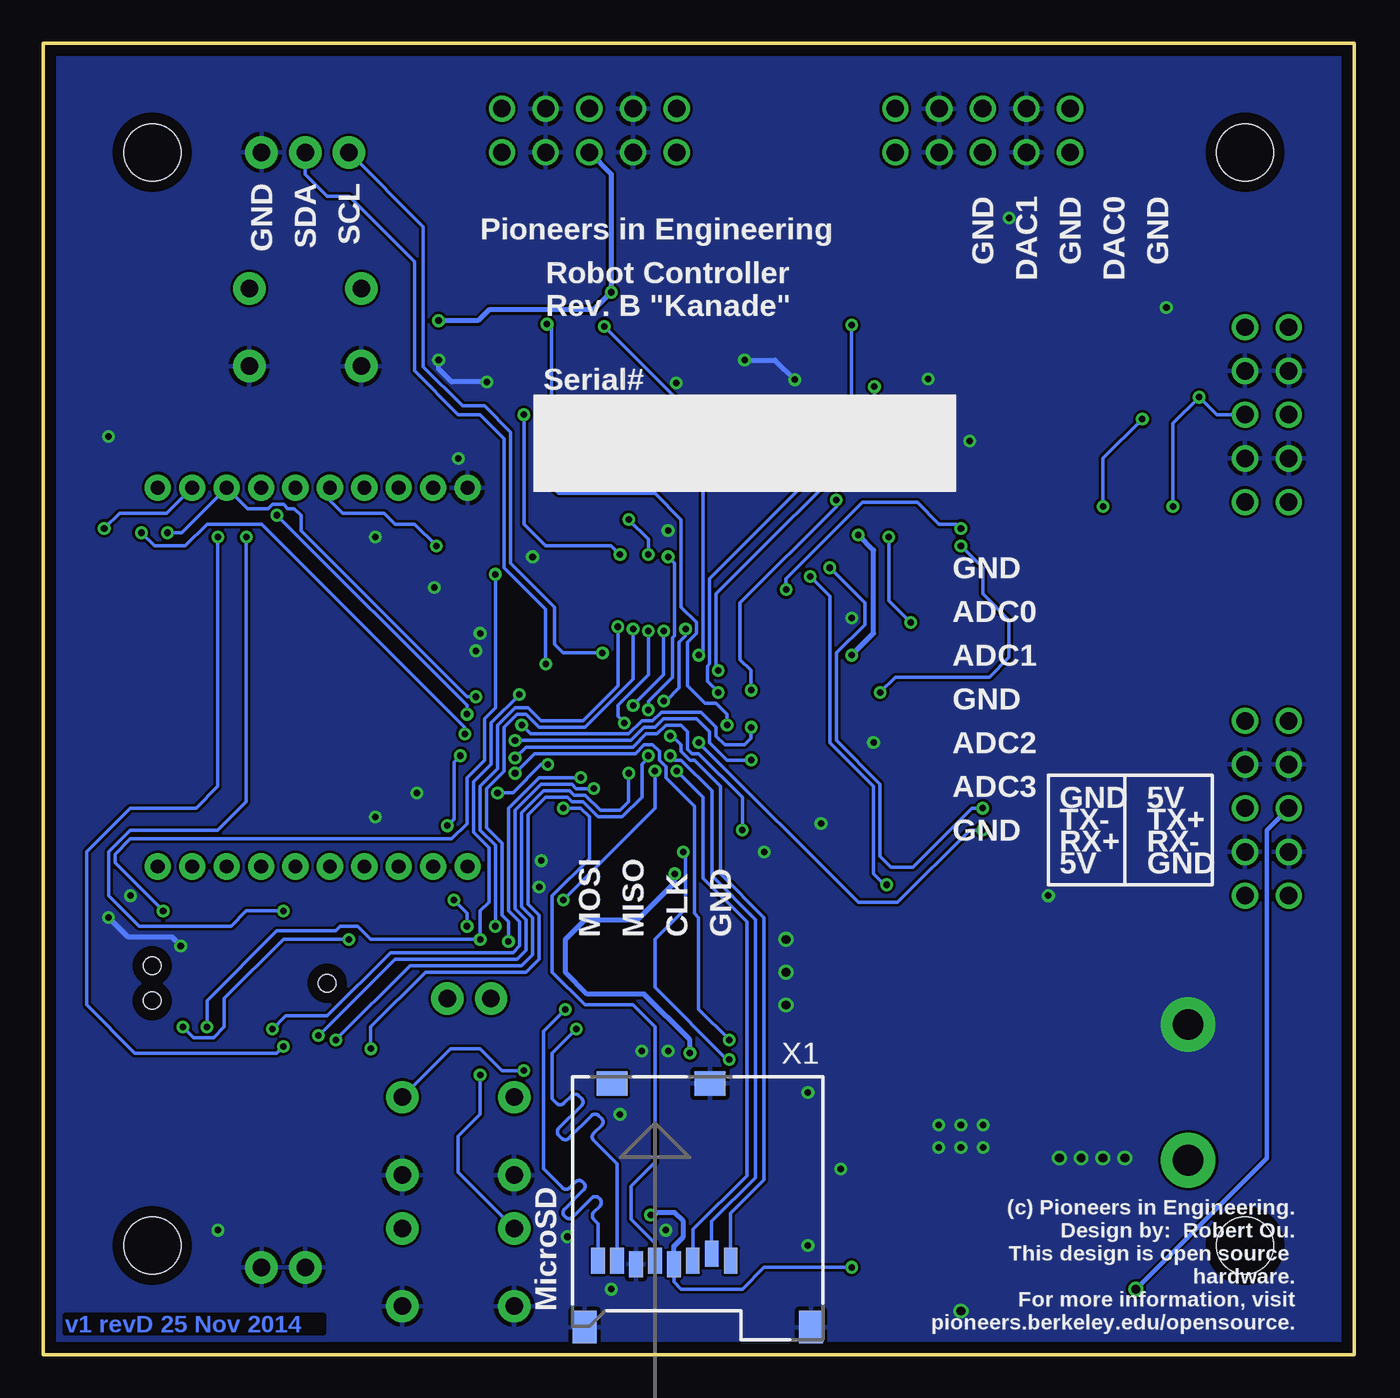
[diagram p6: board, bottom side, seen from below]

Size 76.2 x 76.2 mm. Coordinates in mm from the lower left corner, seen from the top.
Outline: 0,0 76.2,0 76.2,76.2 0,76.2 0,0
Copper layers (1*16): Top 2mil / dielectric 9mil / Bottom 2mil
Design rules "advancedcircuits-33each-pie *": minimum track width 8mil, minimum drill 15mil, track to track 6mil, track to pad 6mil, pad to pad 6mil, via to via 6mil, smd to smd 6mil, copper to edge 25mil, drill to drill 7mil, minimum pad ring 7mil, minimum via ring 7mil, stop-mask expansion 3mil, vias tented up to drill 21mil, thermal gap 10mil

### Footprints (pad centres in the part's own frame; a part is rotated, then mirrored left to right if it is on the bottom)
0805 = smd 0.8 x 1.2: 1 -0.9,0; 2 0.9,0
0603-CAP = smd 1.1 x 1: 1 -0.85,0; 2 0.85,0
1206 = smd 1.6 x 1.8: 1 -1.4,0; 2 1.4,0
2X5_SHROUDED = drill 1.016 pad 1.524: 1 -5.08,-1.27; 2 -5.08,1.27; 3 -2.54,-1.27; 4 -2.54,1.27; 5 0,-1.27; 6 0,1.27; 7 2.54,-1.27; 8 2.54,1.27; 9 5.08,-1.27; 10 5.08,1.27
ANDERSON_HORIZONTAL = smd 8.89 x 1.27: P$1 -5.334,3.937; P$3 -5.334,-3.937 | drill 1.778 pad 3.175: PIN1 0,3.937; PIN2 0,-3.937
TC2070 = smd 0.787 x 0.787: P$1 -3.81,-0.635; P$2 -3.81,0.635; P$3 -2.54,-0.635; P$4 -2.54,0.635; P$5 -1.27,-0.635; P$6 -1.27,0.635; P$7 0,-0.635; P$8 0,0.635; P$9 1.27,-0.635; P$10 1.27,0.635; P$11 2.54,-0.635; P$12 2.54,0.635; P$13 3.81,-0.635; P$14 3.81,0.635 | hole 0.991: -5.08,0; 5.08,1.016; 5.08,-1.016
1X02 = drill 1.016 pad 1.88: 1 -1.27,0; 2 1.27,0
1X03-MTA = drill 1.016 pad 1.88: 1 -2.54,0; 2 0,0; 3 2.54,0
INDUCTOR-6MM = smd 1.9 x 5.7: P$1 -2.55,0; P$2 2.55,0
LED-0805 = smd 1.194 x 1.245: A -1.041,0; C 1.041,0
R0603 = smd 1 x 1.1: 1 -0.85,0; 2 0.85,0
TACTILE-PTH = drill 1.016 pad 1.88: 1 -3.251,2.261; 2 3.251,2.261; 3 -3.251,-2.261; 4 3.251,-2.261
STAND-OFF = hole 3.302: 0,0
QFP64 = smd 1.9 x 0.3: P$1 -5.9,3.75; P$2 -5.9,3.25; P$3 -5.9,2.75; P$4 -5.9,2.25; P$5 -5.9,1.75; P$6 -5.9,1.25; P$7 -5.9,0.75; P$8 -5.9,0.25; P$9 -5.9,-0.25; P$10 -5.9,-0.75; P$11 -5.9,-1.25; P$12 -5.9,-1.75; P$13 -5.9,-2.25; P$14 -5.9,-2.75; P$15 -5.9,-3.25; P$16 -5.9,-3.75; P$33 5.9,-3.75; P$34 5.9,-3.25; P$35 5.9,-2.75; P$36 5.9,-2.25; P$37 5.9,-1.75; P$38 5.9,-1.25; P$39 5.9,-0.75; P$40 5.9,-0.25; P$41 5.9,0.25; P$42 5.9,0.75; P$43 5.9,1.25; P$44 5.9,1.75; P$45 5.9,2.25; P$46 5.9,2.75; P$47 5.9,3.25; P$48 5.9,3.75 | smd 0.3 x 1.9: P$17 -3.75,-5.9; P$18 -3.25,-5.9; P$19 -2.75,-5.9; P$20 -2.25,-5.9; P$21 -1.75,-5.9; P$22 -1.25,-5.9; P$23 -0.75,-5.9; P$24 -0.25,-5.9; P$25 0.25,-5.9; P$26 0.75,-5.9; P$27 1.25,-5.9; P$28 1.75,-5.9; P$29 2.25,-5.9; P$30 2.75,-5.9; P$31 3.25,-5.9; P$32 3.75,-5.9; P$49 3.75,5.9; P$50 3.25,5.9; P$51 2.75,5.9; P$52 2.25,5.9; P$53 1.75,5.9; P$54 1.25,5.9; P$55 0.75,5.9; P$56 0.25,5.9; P$57 -0.25,5.9; P$58 -0.75,5.9; P$59 -1.25,5.9; P$60 -1.75,5.9; P$61 -2.25,5.9; P$62 -2.75,5.9; P$63 -3.25,5.9; P$64 -3.75,5.9
SOIC14 = smd 1.75 x 0.65: 1 -2.8,3.81; 2 -2.8,2.54; 3 -2.8,1.27; 4 -2.8,0; 5 -2.8,-1.27; 6 -2.8,-2.54; 7 -2.8,-3.81; 8 2.8,-3.81; 9 2.8,-2.54; 10 2.8,-1.27; 11 2.8,0; 12 2.8,1.27; 13 2.8,2.54; 14 2.8,3.81
SOIC8 = smd 2 x 0.6: P$1 -2.45,1.905; P$2 -2.45,0.635; P$3 -2.45,-0.635; P$4 -2.45,-1.905; P$5 2.45,-1.905; P$6 2.45,-0.635; P$7 2.45,0.635; P$8 2.45,1.905
BLE-HM-10 = smd 1.676 x 0.813: 1 -6.5,7.79; 2 -6.5,6.29; 3 -6.5,4.79; 4 -6.5,3.29; 5 -6.5,1.79; 6 -6.5,0.29; 7 -6.5,-1.21; 8 -6.5,-2.71; 9 -6.5,-4.21; 10 -6.5,-5.71; 11 -6.5,-7.21; 12 -6.5,-8.71; 13 -6.5,-10.21; 22 6.5,-10.21; 23 6.5,-8.71; 24 6.5,-7.21; 25 6.5,-5.71; 26 6.5,-4.21; 27 6.5,-2.71; 28 6.5,-1.21; 29 6.5,0.29; 30 6.5,1.79; 31 6.5,3.29; 32 6.5,4.79; 33 6.5,6.29; 34 6.5,7.79 | smd 0.813 x 1.676: 14 -5.23,-12; 15 -3.73,-12; 16 -2.23,-12; 17 -0.73,-12; 18 0.77,-12; 19 2.27,-12; 20 3.77,-12; 21 5.27,-12
XBEE-NOSILK = drill 0.8 pad 1.524: 1 -11,6.03; 2 -11,4.03; 3 -11,2.03; 4 -11,0.03; 5 -11,-1.97; 6 -11,-3.97; 7 -11,-5.97; 8 -11,-7.97; 9 -11,-9.97; 10 -11,-11.97; 11 11,-11.97; 12 11,-9.97; 13 11,-7.97; 14 11,-5.97; 15 11,-3.97; 16 11,-1.97; 17 11,0.03; 18 11,2.03; 19 11,4.03; 20 11,6.03
DDA = smd 2.2 x 0.6: P$1 -2.875,1.905; P$2 -2.875,0.635; P$3 -2.875,-0.635; P$4 -2.875,-1.905; P$5 2.875,-1.905; P$6 2.875,-0.635; P$7 2.875,0.635; P$8 2.875,1.905 | smd 2.95 x 4.9: P$9 0,0
SOT223 = smd 1.8 x 0.95: P$1 -3.1,2.3; P$2 -3.1,0; P$3 -3.1,-2.3 | smd 1.8 x 3.2: P$4 3.1,0
USB-MICRO-AB = smd 0.4 x 1.35: P$1 -1.3,1; P$2 -0.65,1; P$3 0,1; P$4 0.65,1; P$5 1.3,1 | smd 2.1 x 1.6: P$6 -3.1,0.875; P$7 3.1,0.875 | smd 1.8 x 1.9: P$8 -4,-1.675; P$9 4,-1.675 | smd 1.9 x 1.9: P$10 -1.2,-1.675; P$11 1.2,-1.675
MICROSD-SOCKET = smd 1.8 x 1.4: CD 2.49,-10.3; P$11 -3.21,-10.3 | smd 0.8 x 1.5: P$1 -4.4,0; P$2 -3.3,-0.4; P$3 -2.2,0; P$4 -1.1,0.2; P$5 0,0; P$6 1.1,0.2; P$7 2.2,0; P$8 3.3,0 | smd 1.4 x 1.9: P$9 -9.06,3.85; P$10 4.09,3.85
HC49UP = smd 5.334 x 1.93: 1 -4.826,0; 2 4.826,0

### Placement (x,y rotation side)
C1  45.72,45.72 0 top
C2  30.48,41.91 90 top
C3  48.26,41.91 270 top
C4  33.02,30.48 270 top
C5  46.21,29.97 0 top
C6  37.59,48.42 0 top
C7  37.59,46.77 0 top
C8  41.71,56.13 180 top
C9  30.48,56.13 180 top
C10  30.99,33.4 270 top
C11  42.93,28.7 270 top
C12  43.18,7.62 0 top
C13  40.01,60.07 270 top
C14  22.23,60.07 270 top
C15  22.86,40.01 0 top
C16  22.86,27.3 0 top
C17  34.29,15.24 180 top
C18  40.51,13.34 0 top
C19  34.29,6.35 180 top
C20  72.01,50.8 90 top
C21  73.91,50.8 90 top
C22  16.51,15.24 270 top
C23  13.97,15.24 270 top
C24  22.86,5.08 270 top
C25  25.4,5.08 270 top
C26  12.7,62.23 270 top
C27  17.78,20.32 90 top
C28  19.05,54.61 0 top
C29  29.21,20.32 0 top
C30  29.21,24.13 0 top
CONN1  5.08,31.75 270 top
CONN2  5.08,54.61 270 top
CONN3  21.59,71.12 180 top
CONN4  44.45,71.12 180 top
CONN5  9.65,15.24 0 top
DBG1  64.77,21.59 0 top
JP3  51.44,20.7 0 top
JP5  60.96,69.85 180 top
JP7  62.23,5.08 180 top
L1  22.86,21.59 90 top
LED1  66.04,11.05 270 top
LED2  63.5,11.05 270 top
LED3  60.96,11.05 270 top
LED4  58.42,11.05 270 top
LED5  58.42,53.34 180 top
R1  30.48,35.94 0 top
R2  49.53,39.62 180 top
R3  45.85,47.88 180 top
R4  66.04,14.86 90 top
R5  63.5,14.86 90 top
R6  60.96,14.86 90 top
R7  58.42,14.86 90 top
R8  26.67,31.75 90 top
R9  26.67,44.45 90 top
R10  29.21,52.07 0 top
R11  48.39,55.88 180 top
R12  16.51,35.56 90 top
R13  16.51,48.26 270 top
R14  31.24,65.79 180 top
R15  49.02,65.79 180 top
R16  29.72,7.49 270 top
R17  62.23,53.34 0 top
R18  15.24,3.81 180 top
R19  19.05,3.81 180 top
R20  16.51,7.62 180 top
R21  60.96,73.66 90 top
R22  58.42,73.66 90 top
R23  16.51,32.26 270 top
R24  16.51,44.96 270 top
R25  27.94,65.79 180 top
R26  45.72,65.79 180 top
R27  11.43,36.83 0 top
R28  11.43,34.29 180 top
R29  11.43,29.21 0 top
R30  11.43,31.75 0 top
R31  11.43,48.01 0 top
R32  11.43,50.55 180 top
R33  11.43,55.63 180 top
R34  11.43,53.09 0 top
R35  34.54,56.64 0 top
R36  34.54,58.93 180 top
R37  34.54,61.21 0 top
R38  34.29,63.5 180 top
R39  52.32,56.64 0 top
R40  52.32,58.93 180 top
R41  52.32,61.21 0 top
R42  52.32,63.5 180 top
S1  60.96,59.69 0 top
S2  52.07,12.7 0 top
S3  52.07,5.08 0 top
STANDOFF1  6.35,6.35 0 top
STANDOFF2  6.35,69.85 0 top
STANDOFF3  69.85,69.85 0 top
STANDOFF4  69.85,6.35 0 top
U1  39.37,38.1 270 top
U2  21.59,33.02 180 top
U3  21.59,45.72 180 top
U4  27.94,60.96 90 top
U5  45.72,60.96 90 top
U6  34.29,11.43 0 top
U7  67.18,39.37 270 top
U8  63.5,39.37 270 top
U9  22.86,12.7 90 top
U10  17.78,60.96 270 top
U$13  [NYAN-1CM]  66.04,34.29 90 top
U$14  [OSHW-LOGO-M]  68.45,56.64 0 top
U$15  [PIE-LOGO-SMALL]  70.87,63.5 0 top
USB1  37.34,3.12 0 top
X1  40.64,5.46 180 bottom
Y1  40.64,52.07 0 top

### Tracks (layer width: path | path; a pad name or v marks a point on that pad's centre or on a via)
3.3V  (via drill 0.38 pad 0.25)
  Top 0.203: 73.86,49.9 C21.1 | 58.47,48.21 58.42,48.26 | R16.2 29.72,5.59 v29.21,5.08 | U1.P$19 34.97,40.85 35.81,40.01 35.81,34.16 35.43,33.78 34.8,33.78 34.29,34.29 33.53,34.29 U1.P$32
  Top 0.305: U10.P$2 U10.P$4 17.78,54.74 | U1.P$19 31.67,40.85 31.46,41.06 C2.1 29.63,41.06 v29.21,40.64 | U1.P$32 33.47,33.09 33.02,32.64 C4.1 | U1.P$48 43.75,32.2 44.45,31.5 44.45,30.88 C5.1 45.87,29.46 45.87,29.06 46.99,27.94 48.26,27.94 | C28.1 17.65,53.47 19.05,52.07 26.67,52.07 28.83,49.91 v28.83,47.62 29.62,48.42 C6.1 C7.1 36.74,45.81 37.12,45.43 U1.P$13 37.12,42.64 38.61,41.15 42.42,41.15 42.8,41.53 43.56,41.53 43.88,41.85 | C1.1 43.56,45.72 43.12,45.28 U1.P$1 43.12,42.99 43.56,42.55 43.56,42.17 43.88,41.85 | 43.88,41.85 U1.P$64 46.55,41.85 47.46,42.76 C3.1 50.38,42.76 50.8,43.18 | v40.89,8.13 41.4,7.62 C12.1 42.33,9.31 43.18,10.16 44.45,10.16 46.99,12.7 50.8,12.7 52.7,14.61 JP3.2 | 44.82,47.7 R3.2 | 50.8,43.18 50.8,45.72 53.34,48.26 58.42,48.26 61.85,48.26 62.23,47.88 63.12,47.88 63.5,48.26 67.42,48.26 U8.1 70,49.9 C20.1 72.06,49.95 C21.1 | U7.12 58.47,48.21 | DBG1.P$1 60.96,20.32 59.69,19.05 58.42,19.05 56.77,20.7 JP3.2 | 48.26,27.94 51.82,31.5 51.82,33.53 52.7,34.42 52.7,41.27 50.8,43.18 | 48.26,27.94 49.78,26.42 51.05,26.42 52.7,24.77 JP3.2
  Top 0.356: 17.78,54.74 C28.1
  Top 0.406: 44.77,47.65 R3.2 44.83,47.71 44.83,45.72 C1.1
  Bottom 0.203: v29.21,5.08 34.29,5.08 35.56,3.81 39.12,3.81 39.54,4.23 X1.P$4
  Bottom 0.305: X1.P$4 39.54,6.31 38.99,6.86 38.99,7.75 39.5,8.26 40.77,8.26 v40.89,8.13 | v29.21,40.64 27.94,41.91 27.94,46.74 v28.83,47.62
5V  (via drill 0.38, 0.51)
  Top 0.203: R18.2 v12.7,3.81 | R21.2 R22.2 54.19,74.51 53.34,73.66 | R31.2 12.28,48.05 11.05,49.28 v10.54,49.28 | v9.02,55.63 R33.2
  Top 0.305: 34.92,27.3 35.18,27.05 35.18,20.83 37.27,18.73 37.27,17.08 36.58,16.38 35.43,16.38 35.14,16.09 | v43.18,61.72 U5.13 | R41.2 53.21,61.17 v53.21,60.07 52.7,60.07 52.32,59.69 52.32,57.53 53.17,56.68 R39.2 | U3.14 20.11,41.91 C15.1 | C16.1 22.01,24.98 L1.P$2 | R37.2 35.39,61.17 34.54,60.33 34.54,57.49 R35.2
  Top 0.356: U6.P$7 35.18,12.06 34.54,12.7 34.54,13.84 35.14,14.44 C17.1 35.14,16.09 | 35.14,27.09 34.92,27.3 34.29,27.94 30.35,27.94 28.45,26.04
  Bottom 0.203: v10.54,49.28 10.54,54.1 v9.02,55.63 8,54.61 CONN2.6
  Bottom 0.254: CONN1.5 5.08,30.48 5.08,11.43 v12.7,3.81
  Bottom 0.305: CONN4.6 43.18,68.58 v43.18,61.72 44.2,60.71 50.29,60.71 50.93,60.07 v53.21,60.07
  pour Top: 28.96,18.41 26.42,18.41 26.42,21.59 0,21.59 0,76.2 54.61,76.2 54.61,57.15 19.05,57.15 19.05,26.67 28.96,26.67
  pour Top (no thermals): 19.05,25.4 19.05,22.86 26.67,22.86 26.67,19.05 28.96,19.05 28.96,25.4
12V
  Top 0.203: R20.2 11.43,7.62
  pour Top (no thermals): 0,0 -0.13,21.08 21.08,21.08 21.21,15.49 11.43,15.49 11.43,0
  pour Top (no thermals): 19.56,17.78 19.56,14.48 21.21,14.48 21.21,17.78
A_TX1_N
  Top 0.203: CONN1.2 R27.1 11.6,35.81 15.88,35.81 16.47,36.41 R12.2 17.31,36.41 17.53,36.2 19.81,36.2 20.19,35.81 20.19,35.05 19.56,34.42 18.92,34.42 U2.10
A_TX1_P
  Top 0.203: CONN1.1 5.08,35.56 7.62,35.56 8.89,34.29 R28.2 11.6,35.31 15.88,35.31 16.47,34.71 R12.1 17.44,34.71 18.16,35.43 18.66,35.43 U2.9
A_TX2_N  (via drill 0.38)
  Top 0.203: U3.10 17.65,46.99 17.53,47.12 17.53,47.24 17.36,47.41 R13.2 16.47,47.41 v14.61,49.28 | v12.32,54.36 12.32,55.59 R33.1 12.28,55.79 8.38,59.69 CONN2.2
  Bottom 0.203: v14.61,49.28 14.61,52.07 v12.32,54.36
A_TX2_P
  Top 0.203: CONN2.1 5.08,58.42 7.37,58.42 8.26,57.53 8.26,55.12 9.02,54.36 11.05,54.36 12.28,53.12 R34.2 13.72,53.09 16.51,50.29 R13.1 16.6,49.02 17.4,49.02 17.53,48.9 17.53,48.39 17.65,48.26 U3.9
A_TX3_N
  Top 0.203: R37.1 33.69,61.3 32.77,62.23 30.23,62.23 29.34,63.12 29.34,63.63 U4.10 29.21,64.77 29.34,64.9 30.1,64.9 30.23,65.02 30.23,65.62 R14.2 30.39,67.53 28.07,69.85 CONN3.2
A_TX3_P
  Top 0.203: U4.9 30.48,64.77 30.61,64.9 31.88,64.9 | R38.2 33.4,63.54 33.4,64.77 33.27,64.9 31.88,64.9 | 31.88,64.9 31.88,65.57 R14.1 32.09,69.51 29.21,72.39 CONN3.1
A_TX4_N
  Top 0.203: 51.47,61.3 50.55,62.23 48.01,62.23 47.12,63.12 | U5.10 46.99,64.77 47.12,64.9 47.88,64.9 48.01,65.02 48.01,65.62 R15.2 | 48.13,65.75 R15.2 | R15.2 48.17,68.49 CONN4.2
  Top 0.305: R41.1 51.47,61.3 | 47.12,63.12 47.12,63.63 U5.10
A_TX4_P
  Top 0.203: U5.9 48.26,64.77 48.39,64.9 49.53,64.9 | 49.53,64.9 49.66,65.02 | 49.66,65.02 49.66,65.75 49.83,65.75 R15.1 49.91,65.79 50.8,66.67 50.8,71.12 CONN4.1 | R42.2 51.47,64.73 51.31,64.9 49.78,64.9 | 49.78,64.9 49.66,65.02 | 49.53,64.9 49.78,64.9
B_RX1_N
  Top 0.203: CONN1.9 5.08,27.94 6.73,27.94 9.27,30.48 11.01,30.48 R30.2 15.15,31.75 R23.1 18.7,33.11 U2.11
B_RX1_P
  Top 0.203: CONN1.10 8.89,29.21 R29.1 10.58,29.25 11.81,30.48 15.58,30.48 R23.2 17.31,31.41 17.65,31.75 U2.12
B_RX2_N
  Top 0.203: CONN2.9 5.08,50.8 10.33,50.8 R32.2 11.72,49.4 12.7,49.4 16.3,45.81 R24.1 18.7,45.81 U3.11
B_RX2_P
  Top 0.203: CONN2.10 7.87,48.01 R31.1 14.48,44.11 R24.2 17.44,44.11 17.53,44.2 17.53,44.32 17.65,44.45 U3.12
B_RX3_N
  Top 0.203: R36.2 33.69,59.02 32.89,59.82 32.89,60.33 31.5,61.72 29.46,61.72 27.94,63.25 U4.11 27.94,64.77 28.07,64.9 28.45,64.9 28.57,65.02 28.57,65.57 R25.1 28.79,66.59 28.57,66.8 21.59,66.8 20.57,67.82 19.3,67.82 17.78,69.34 17.78,71.12 CONN3.9
B_RX3_P
  Top 0.203: R35.1 33.69,56.73 32.38,58.04 32.38,60.07 31.24,61.21 28.7,61.21 26.8,63.12 26.8,63.63 U4.12 26.67,64.77 26.92,65.02 26.92,65.62 R25.2 21.84,65.79 20.32,67.31 19.05,67.31 CONN3.10
B_RX4_N
  Top 0.203: 51.47,59.02 50.67,59.82 50.67,60.33 49.28,61.72 47.24,61.72 45.85,63.12 | U5.11 45.72,64.77 45.85,64.9 46.23,64.9 46.35,65.02 46.35,65.57 R26.1 46.57,66.59 46.35,66.8 43.18,66.8 40.77,69.22 40.77,70.99 CONN4.9
  Top 0.305: R40.2 51.47,59.02 | 45.85,63.12 45.85,63.63 U5.11
B_RX4_P
  Top 0.203: 51.44,56.64 50.16,57.91 50.16,60.07 49.02,61.21 46.35,61.21 44.58,62.99 | U5.12 44.45,64.77 44.7,65.02 44.7,65.62 R26.2 | 44.96,65.7 R26.2 | R26.2 43.43,65.79 CONN4.10
  Top 0.305: R39.1 51.44,56.64 | 44.58,62.99 44.58,63.63 U5.12
BOOT0  (via drill 0.38 pad 0.25)
  Top 0.203: U1.P$60 46.38,39.85 46.86,39.37 47.5,39.37 47.75,39.62 R2.2 48.68,38.52 v48.51,38.35 | JP3.1 50.16,23.5 v50.8,24.13 | DBG1.P$9 66.04,19.68 v66.67,19.05
  Bottom 0.203: v48.51,38.35 50.16,36.7 50.16,34.29 51.18,33.27 51.18,30.35 50.29,29.46 50.29,26.29 50.8,25.78 v50.8,24.13 57.15,24.13 57.91,24.89 58.93,24.89 59.18,24.64 62.61,24.64 66.67,20.57 v66.67,19.05
BOOT1
  Top 0.203: U1.P$28 32.29,36.35 31.88,35.94 R1.2
BTLE_DEBUG_C  (via drill 0.38 pad 0.25)
  Top 0.203: v62.23,25.78 DBG1.P$4 | U7.8 64.47,47.41 v64.39,47.5
  Bottom 0.203: v64.39,47.5 64.39,32.13 66.04,30.48 71.12,30.48 72.39,29.21 72.39,26.67 70.61,24.89 65.28,24.89 64.39,25.78 v62.23,25.78
BTLE_DEBUG_D  (via drill 0.38 pad 0.25)
  Top 0.203: U7.7 65.97,47.43 v66.04,47.5 | v62.23,17.91 DBG1.P$3
  Bottom 0.203: v66.04,47.5 66.04,33.02 67.31,31.75 71.12,31.75 73.66,29.21 73.66,20.32 70.87,17.53 62.61,17.53 v62.23,17.91
BUTTON0  (via drill 0.38 pad 0.25)
  Top 0.203: U1.P$3 42.12,42.84 42.29,42.67 42.42,42.67 v42.8,42.29 | v48.26,16.51 48.82,15.95 S2.1 48.84,14.99 50.8,14.99 51.56,15.75 51.56,16.64 48.39,19.81 48.39,22.35 49.91,23.88 v49.91,24.89
  Bottom 0.203: v42.8,42.29 42.8,38.86 44.83,36.83 47.24,36.83 48.01,37.59 48.77,37.59 49.78,36.58 49.78,34.04 50.8,33.02 50.8,30.48 49.91,29.59 v49.91,24.89 | v48.26,16.51 49.53,16.51 50.8,17.78 52.5,17.78 S2.2
BUTTON1  (via drill 0.38 pad 0.25)
  Top 0.203: U1.P$4 41.62,42.45 v41.91,42.16 | v49.15,24 48.01,22.86 48.01,18.54 50.29,16.26 v50.8,16.26 | S3.1 S3.2
  Bottom 0.203: v41.91,42.16 41.91,39.24 44.7,36.45 47.37,36.45 48.13,37.21 48.64,37.21 49.4,36.45 49.4,33.91 50.42,32.89 50.42,30.61 49.53,29.72 49.53,25.53 49.15,25.15 v49.15,24 | v50.8,16.26 50.8,13.97 52.07,12.7 52.07,10.59 S3.1
GND  (via drill 0.38, 0.38 pad 0.25, 0.51)
  Top 0.203: R1.1 28.32,35.94 v27.94,35.56 | v51.05,40.89 51.05,40.3 R2.1 | v52.07,52.07 56.11,52.07 LED5.C | CONN2.8 7.37,53.09 R34.1 12.28,51.39 R32.1 | CONN1.8 8.89,31.75 R30.1 10.58,31.79 12.19,33.4 12.19,34.2 R28.1 | R8.1 25.87,30.9 25.65,31.11 25.65,31.62 25.53,31.75 U2.3
  Top 0.305: LED4.C LED3.C LED2.C LED1.C | LED1.C v66.04,7.24 | U1.P$18 31.89,41.35 C2.2 29.25,42.76 v29.21,42.8 28.41,43.6 R9.1 25.82,44.45 U3.3 22.35,44.45 | C10.2 v30.99,30.86 | C4.2 33.87,29.63 v34.29,29.21 | U1.P$63 47.17,41.35 47.46,41.06 C3.2 49.95,41.06 v50.8,41.91 | C21.2 72.39,51.65 | 72.39,51.65 72.06,51.65 | U6.P$3 v29.84,10.79 | C26.2 v10.93,60.83 v10.92,60.83 | U10.P$1 20.08,66.03 v20.07,66.04 | C12.2 44.96,7.62 v45.72,6.86 | C18.2 42.04,13.34 v42.67,13.97 | C28.2 20.45,54.48 21.85,54.48 22.35,53.98 v22.35,53.09 | U7.13 56.97,47.42 v56.9,47.5 | U7.14 53.49,44.6 v53.47,44.58 | U7.22 56.97,31.32 v56.9,31.24 | DBG1.P$14 DBG1.P$12 67.31,22.86 v68.2,23.75 | v39.88,47.88 39.34,48.42 C6.2 C7.2 38.44,46.06 37.62,45.24 U1.P$12 | C1.2 47.12,45.72 v47.75,46.35 | C5.2 47.06,28.88 v47.24,28.7 | v40.01,7.24 40.13,7.24 40.89,6.48 41.4,6.48 41.78,6.1 41.78,5.21 v43.18,3.81 | v39.88,17.65 v41.4,17.65 | C17.2 v31.75,15.24 | v47.37,27.18 46.99,27.18 46.61,27.56 45.59,27.56 45.3,27.85 C11.2 | v71.12,26.67 v72.39,25.4 72.39,16.51 66.04,10.16 LED1.C | 48.26,60.73 48.81,60.73 49.53,60.01 U5.7 49.53,57.66 50.42,56.77 v50.42,56.52 50.42,56.26 50.04,55.88 R11.1 49.53,55.88 | 48.26,60.73 44.45,60.73 | 44.45,60.73 41.52,60.73 C13.2 40.01,57.78 39.37,57.15 39.37,56.49 v39.4,56.46 39.43,56.46 39.75,56.13 C8.2 | R10.1 24.77,55.66 v24.77,56.69 | U5.6 48.26,60.73 | U7.21 55.18,33.34 v54.48,32.64 | v72.39,53.34 72.01,52.96 C20.2 72.34,51.7 72.39,51.65 | v53.21,57.78 53.21,58.89 R40.1 53.17,59.02 54.1,59.94 54.1,62.57 R42.1 53.17,68.58 | CONN4.8 CONN4.7 43.18,73.66 46.61,73.66 | CONN4.4 CONN4.3 46.99,73.28 | 53.17,68.58 53.17,71.29 50.8,73.66 47.37,73.66
  Top 0.305: 46.61,73.66 46.99,73.66 | 46.99,73.28 46.99,73.66 | 46.99,73.28 47.37,73.66 | 47.37,73.66 46.99,73.66 | 46.61,73.66 46.99,73.28 | U5.3 44.45,60.73 | JP5.1 62.23,68.58 53.59,68.58 | 53.17,68.58 53.59,68.58 | 53.59,68.58 53.21,68.96 53.21,68.2 53.59,68.58 | C14.2 23.73,60.73 26.67,60.73 | 30.48,60.73 26.67,60.73 | U4.3 26.67,60.73 | 30.48,60.73 U4.6 30.35,58.03 30.35,57.53 29.63,56.81 C9.2 | 30.48,60.73 31.03,60.73 31.75,60.01 U4.7 31.88,58.03 31.88,57.53 32.51,56.9 v32.51,56.64 | R36.1 35.39,57.82 v35.43,57.78 36.07,57.78 36.45,58.17 36.45,62.19 R38.1 | U3.7 U3.6 23.88,48.26 23.11,49.02 22.48,49.02 21.97,48.51 21.97,44.83 | 21.97,44.32 21.97,44.07 | 21.97,44.07 21.97,41.74 C15.2 23.62,40.01 22.99,39.37 22.99,37.72 23.75,36.96 24.26,36.96 U2.7 U2.6 | 21.97,44.32 22.1,44.45 22.35,44.45 | 22.35,44.45 21.97,44.83 | 21.97,44.83 21.97,44.32 | 21.97,44.07 22.35,44.45 | C16.2 23.71,27.34 22.86,28.19 | 22.86,28.19 22.73,28.32 22.48,28.32 | 22.48,28.32 19.43,28.32 v17.78,26.67 | U2.3 23.75,31.75 22.86,30.86 22.86,28.7 | 22.86,28.7 22.86,28.19 | 22.48,28.32 22.86,28.7 | LED1.C 66.14,10.01
  Top 0.356: C19.2 v31.75,6.35 | USB1.P$5 38.64,5.87 v40.01,7.24
  Top 0.508: C24.2 v22.86,2.54 | R19.1 19.9,2.33 20.95,1.27 25.4,1.27 | C25.2 25.4,1.27 | 25.4,1.27 26.67,1.27 27.94,2.54 27.94,11.43
  Bottom 0.305: v50.42,56.52 52.45,56.52 53.21,57.28 v53.21,57.78 | v68.2,23.75 68.71,24.26 71.25,24.26 v72.39,25.4 | v35.43,57.78 33.66,57.78 v32.51,56.64
  other vias: 21.56,13.35 21.56,12.05 22.86,13.35 22.86,12.05 24.16,13.35 24.16,12.05 13.34,11.43 14.61,11.43 15.88,11.43 17.14,11.43 33.02,24.13 33.02,22.23 33.02,20.32
  pour Bottom: 0,0 0,76.2 76.2,76.2 76.2,0
  pour Top: 19.05,14.99 11.94,14.99 11.94,8.89 19.05,8.89 19.05,11.43 33.02,11.43 33.02,15.24 34.29,15.24 34.29,26.67 29.46,26.67 29.46,17.78 26.67,17.78 26.67,13.97 19.05,13.97
  pour Top (no thermals): 24.51,16.64 24.51,13.84 26.67,13.84 26.67,16.64
  pour Top (no thermals): 29.46,26.67 29.46,18.8 31.75,18.8 31.75,26.67
  pour Bottom (no thermals): 7.62,21.59 7.62,16.51 11.81,16.51 11.81,21.59
  pour Top (no thermals): 12.7,14.99 12.7,12.57 17.78,12.57 17.78,14.99
I2C_SCL  (via drill 0.38 pad 0.25)
  Top 0.203: U1.P$61 44.1,40.35 v43.69,40.77 | R22.1 JP5.3
  Bottom 0.203: JP5.3 54.1,65.53 54.1,57.4 51.82,55.12 50.55,55.12 49.02,53.59 49.02,45.97 46.48,43.43 46.48,41.27 45.97,40.77 v43.69,40.77
I2C_SDA  (via drill 0.38 pad 0.25)
  Top 0.203: U1.P$62 46.65,40.85 46.99,40.51 v46.99,40.13 | R21.1 JP5.2
  Bottom 0.203: v46.99,40.13 46.99,43.31 49.4,45.72 49.4,53.21 50.8,54.61 52.07,54.61 54.61,57.15 54.61,63.5 58.42,67.31 59.69,67.31 60.96,68.58 JP5.2
LED_BLU  (via drill 0.38 pad 0.25)
  Top 0.203: U1.P$10 38.62,45.22 38.99,45.59 39.62,45.59 39.88,45.85 v39.88,46.35 | v41.02,37.47 41.02,36.7 41.66,36.07 41.66,34.29 v42.16,33.78 | v59.18,18.29 59.18,17.49 R6.2
  Bottom 0.203: v41.02,37.47 41.02,37.97 39.62,39.37 39.62,41.66 39.5,41.78 39.5,45.97 v39.88,46.35 | v42.16,33.78 42.16,32.13 42.67,31.62 43.81,31.62 44.7,32.51 45.34,32.51 45.59,32.77 47.12,32.77 48.39,31.5 48.39,26.04 47.75,25.4 47.75,23.24 48.39,22.61 54.86,22.61 v59.18,18.29
LED_GRN  (via drill 0.38 pad 0.25)
  Top 0.203: U1.P$9 39.12,42.8 39.88,42.04 v40.13,42.04 | v41.91,37.72 41.91,37.08 41.78,36.96 41.78,36.45 42.04,36.2 42.04,34.8 43.18,33.66 43.43,33.66 v44.2,32.89 | v60.2,18.54 60.67,18.54 R5.2
  Bottom 0.203: v41.91,37.72 40.13,39.5 v40.13,42.04 | v44.2,32.89 45.21,32.89 45.47,33.15 47.24,33.15 48.77,31.62 48.77,25.91 48.13,25.27 48.13,23.5 48.64,22.99 55.75,22.99 v60.2,18.54
LED_RED  (via drill 0.38 pad 0.25)
  Top 0.203: U1.P$8 39.62,42.8 39.75,42.67 40.39,42.67 v41.02,42.04 | v42.42,36.7 42.42,34.92 43.31,34.04 43.94,34.04 44.45,33.53 v44.96,33.53 | v62.87,18.92 62.87,18.88 R4.2
  Bottom 0.203: v42.42,36.7 42.8,37.08 42.8,37.72 41.02,39.5 v41.02,42.04 | v44.96,33.53 47.37,33.53 49.15,31.75 49.15,25.78 48.51,25.15 48.51,23.75 48.9,23.37 56.01,23.37 59.69,19.68 62.1,19.68 v62.87,18.92
LED_YEL  (via drill 0.38 pad 0.25)
  Top 0.203: U1.P$11 38.12,42.65 38.23,42.55 38.48,42.55 v38.86,42.16 | v40.13,37.97 40.13,36.7 40.77,36.07 40.77,35.05 v41.02,34.8 | v57.15,17.78 57.15,16.98 R7.2
  Bottom 0.203: v40.13,37.97 40.01,37.97 39.24,38.73 39.24,41.4 38.86,41.78 v38.86,42.16 | v41.02,34.8 41.02,34.67 41.4,34.29 41.4,32.38 42.55,31.24 43.94,31.24 44.83,32.13 45.47,32.13 45.72,32.38 46.99,32.38 48.01,31.37 48.01,26.16 47.37,25.53 47.37,22.99 48.13,22.23 53.98,22.23 57.15,19.05 v57.15,17.78
N$2
  Top 0.305: U1.P$47 42.62,30.91 42.93,30.61 C11.1
N$3
  Top 0.305: U1.P$31 31.59,34.85 C10.1
N$4
  Top 0.203: 35.98,52.24 Y1.1 36.96,52.07 39.37,52.07 40.39,51.05 40.39,48.51 41.66,47.24 41.66,46.23 40.64,45.21 40.64,44.02 U1.P$6
  Top 0.305: 36.96,52.07 36.32,52.7 33.53,52.7 31.33,54.9 C9.1
N$5
  Top 0.305: LED1.A R4.1
N$6
  Top 0.203: 45.3,52.24 Y1.2 | U1.P$5 41.12,45.18 42.04,46.1 42.04,47.5 40.89,48.64 40.89,51.05 41.91,52.07 Y1.2 | Y1.2 45.47,54.61 43.94,56.13 C8.1
N$7
  Top 0.305: LED2.A R5.1
N$8
  Top 0.305: LED3.A R6.1
N$9
  Top 0.305: LED4.A R7.1
N$10
  Top 0.203: R17.1 LED5.A
N$12
  Top 0.254: U9.P$7 22.23,16.89 21.59,17.53 19.94,17.53 19.56,17.91 19.56,18.92 19.01,19.47 C27.1
N$13
  Top 0.508: U9.P$4 24.77,7.75 25.4,7.11 C25.1
N$14
  Top 0.508: U9.P$3 23.5,7.75 22.86,7.11 C24.1
N$15
  Top 0.203: R18.1 R19.2 18.2,5.37 19.18,6.35 21.59,6.35 22.23,6.99 U9.P$2
N$16
  Top 0.203: U9.P$1 20.95,8.26 20.32,7.62 R20.1
N$17
  Top 0.203: L1.P$1
  Top 0.254: C27.2 22.01,21.17 22.86,20.32 L1.P$1
  Top 0.635: U9.P$6 23.5,17.78 | 23.5,17.78 23.5,18.41 L1.P$1 | 22.23,19.05 23.5,17.78 | 23.5,17.78 24.77,19.05
NRST  (via drill 0.38, 0.38 pad 0.25)
  Top 0.203: S1.2 S1.1 57.63,61.95 56.26,60.58 56.26,56.39 54.74,54.86 51.05,54.86 49.53,53.34 49.53,49.53 47.88,47.88 | 47.88,47.88 R3.1 46.7,49.06 46.48,49.28 42.93,49.28 v42.16,48.51 | U1.P$7 40.12,45.33 41.02,46.23 v41.02,46.48 | 47.88,47.88 47.88,47.37 v49.91,45.34 | v69.22,25.78 67.06,25.78 66.04,24.77 DBG1.P$10
  Bottom 0.203: v41.02,46.48 41.02,47.37 v42.16,48.51 | v49.91,45.34 49.91,37.59 50.55,36.96 50.55,34.54 51.56,33.53 51.56,30.86 52.45,29.97 71.12,29.97 72.01,29.08 72.01,28.57 v69.22,25.78
RADIO_CLK  (via drill 0.38 pad 0.25)
  Top 0.203: U1.P$33 35.62,30.54 v35.56,30.48 | U7.4 v70.47,47.74 v70.48,47.75 | v48.77,34.67 50.29,34.67 v51.69,36.07
  Bottom 0.203: v35.56,30.48 35.56,32.38 38.1,34.92 38.48,34.92 38.73,35.18 38.73,36.2 39.12,36.58 40.01,36.58 40.51,36.07 41.15,36.07 41.91,35.31 48.13,35.31 v48.77,34.67 | v70.48,47.75 69.72,46.99 67.94,46.99 66.67,48.26 63.5,48.26 51.69,36.45 v51.69,36.07
RADIO_LED  (via drill 0.38 pad 0.25)
  Top 0.203: U7.24 59.97,31.27 59.18,30.48 55.12,30.48 53.21,32.38 53.21,43.81 52.58,44.45 52.58,46.23 v53.34,46.99 | U8.6 59.53,50.89 60.71,52.07 61.81,52.07 R17.2
  Bottom 0.203: v53.34,46.99 54.61,48.26 55.75,48.26 56.39,48.9 58.8,48.9 59.53,49.62 U8.6
RADIO_RX_MISO  (via drill 0.38 pad 0.25)
  Top 0.203: U7.2 73.47,47.18 v72.64,48.01 | v62.61,48.77 65.93,48.77 U8.2 | v48.77,35.69 50.04,35.69 v51.56,37.21 | U1.P$30 34.88,35.35 35.05,35.18 v35.05,34.54
  Bottom 0.203: v72.64,48.01 71.75,48.9 69,48.9 U8.2 | v35.05,34.54 36.45,34.54 37.47,35.56 37.47,36.2 38.23,36.96 40.13,36.96 40.64,36.45 41.27,36.45 42.04,35.69 v48.77,35.69 | 62.61,48.64 v62.61,48.77 51.56,37.72 v51.56,37.21
RADIO_TX_MOSI  (via drill 0.38 pad 0.25)
  Top 0.203: U7.1 74.97,47.71 73.91,48.77 69.98,48.77 v68.96,47.75 | v48.39,36.58 49.4,36.58 v51.05,38.23 | U1.P$29 33.51,35.81 34.8,35.81 35.05,36.07 v35.05,36.45
  Bottom 0.203: v68.96,47.75 68.15,47.75 U8.3 64.31,49.15 63.12,49.15 62.87,49.4 62.23,49.4 61.98,49.15 61.59,49.15 61.21,48.77 61.21,47.88 51.56,38.23 v51.05,38.23 | v48.39,36.58 47.88,36.07 42.16,36.07 41.4,36.83 40.77,36.83 40.26,37.34 37.97,37.34 37.08,36.45 37.08,35.94 36.58,35.43 35.43,35.43 35.05,35.81 v35.05,36.45
RS485_1_RX  (via drill 0.38 pad 0.25)
  Top 0.203: U1.P$15 36.12,45.29 35.94,45.47 33.27,45.47 33.02,45.72 32.13,45.72 v31.62,45.21 | v27.18,27.3 27.18,28.32 25.02,30.48 U2.2
  Bottom 0.203: v27.18,27.3 27.3,27.3 27.94,27.94 27.94,33.02 30.48,35.56 30.48,44.07 v31.62,45.21
RS485_1_TX  (via drill 0.38 pad 0.25)
  Top 0.203: U1.P$14 36.62,45.3 35.94,45.97 34.04,45.97 33.02,46.99 31.75,46.99 v30.48,45.72 | U2.5 22.86,34.29 21.59,33.02 v21.59,31.75
  Bottom 0.203: v30.48,45.72 28.45,43.69 28.45,42.42 30.1,40.77 30.1,35.69 27.56,33.15 27.56,28.96 26.92,28.32 25.65,28.32 22.23,31.75 v21.59,31.75
RS485_1_TXEN  (via drill 0.38 pad 0.25)
  Top 0.203: U1.P$55 44.18,37.35 43.69,37.85 43.69,38.73 42.67,39.75 39.12,39.75 37.72,38.35 37.72,35.94 v38.1,35.56 | R8.2 25.95,32.6 25.78,32.77 25.78,32.89 25.65,33.02 U2.4 23.88,33.02 21.59,30.73 v21.59,30.48
  Bottom 0.203: v21.59,30.48 22.35,30.48 26.54,26.29 28.83,26.29 v38.1,35.56
RS485_2_RX  (via drill 0.38 pad 0.25)
  Top 0.203: v27.05,47.5 30.61,43.94 32.26,43.94 33.47,42.73 U1.P$17 | v25.78,42.55 25.53,42.55 24.89,43.18 U3.2
  Bottom 0.203: v27.05,47.5 27.05,43.81 v25.78,42.55
RS485_2_TX  (via drill 0.38 pad 0.25)
  Top 0.203: v33.02,44.45 33.47,44 U1.P$16 | U3.5 23.88,46.99 v22.86,48.01
  Bottom 0.203: v33.02,44.45 33.02,45.09 28.57,49.53 25.4,49.53 24.13,48.26 23.11,48.26 v22.86,48.01
RS485_2_TXEN  (via drill 0.38 pad 0.25)
  Top 0.203: 27.69,38.35 v27.56,38.48 27.69,38.35 U1.P$24 | v22.86,46.99 22.86,46.74 23.75,45.85 24.26,45.85 U3.4 24.89,45.72 25.4,45.21 26.58,45.21 R9.2
  Bottom 0.203: v22.86,46.99 21.59,45.72 21.59,44.2 20.07,42.67 20.07,40.51 21.21,39.37 26.67,39.37 v27.56,38.48
RS485_3_RX  (via drill 0.38 pad 0.25)
  Top 0.203: U1.P$59 44.09,39.35 42.93,40.51 38.86,40.51 38.1,39.75 v36.96,39.75 | U4.2 25.4,57.66 26.8,56.26 27.86,56.26 v27.89,56.24
  Bottom 0.203: v36.96,39.75 37.08,39.88 37.08,44.2 27.89,53.39 v27.89,56.24
RS485_3_TX  (via drill 0.38 pad 0.25)
  Top 0.203: U1.P$58 44.08,38.85 42.8,40.13 38.99,40.13 38.23,39.37 37.85,39.37 v36.96,38.48 | U4.5 v29.21,59.82
  Bottom 0.203: v36.96,38.48 37.59,39.12 37.59,40.01 37.47,40.13 37.47,45.09 30.42,52.13 29.91,52.64 29.21,53.34 v29.21,59.82
RS485_3_TXEN  (via drill 0.38 pad 0.25)
  Top 0.203: v30.1,49.66 30.06,49.7 R10.2 30.06,53.76 28.7,55.12 28.7,56.9 28.07,57.53 28.07,58.03 U4.4 | U1.P$25 34.8,37.85 35.05,38.1 v35.05,38.61
  Bottom 0.203: v30.1,49.66 30.1,49.28 35.69,43.69 35.69,40.39 35.05,39.75 v35.05,38.61
RS485_4_RX  (via drill 0.38, 0.38 pad 0.25)
  Top 0.203: 43.18,57.66 U5.2 43.18,59.33 v43.59,59.74 | U1.P$38 38.12,34.52 37.08,35.56 37.08,37.34 36.32,38.1 36.32,40.01 36.83,40.51 37.97,40.51 v38.1,40.64
  Bottom 0.203: v38.1,40.64 37.85,40.89 37.85,54 v43.59,59.74
RS485_4_TX  (via drill 0.38 pad 0.25)
  Top 0.203: v36.45,36.58 36.45,35.18 37.62,34.01 U1.P$37 | v46.91,59.87 46.99,59.79 U5.5
  Bottom 0.203: v36.45,36.58 36.45,37.21 37.08,37.85 37.72,37.85 38.73,38.86 38.73,41.4 38.23,41.91 38.23,42.55 39.12,43.43 39.12,48.51 40.64,50.04 46.23,50.04 46.99,50.8 46.99,55.27 46.63,55.63 46.63,59.59 v46.91,59.87
RS485_4_TXEN  (via drill 0.38 pad 0.25)
  Top 0.203: U5.4 45.72,57.53 46.48,56.77 46.48,56.26 46.86,55.88 R11.2 48.26,55.16 v48.26,54.61 | U1.P$2 42.62,46.43 v42.67,46.48
  Bottom 0.203: v48.26,54.61 48.26,48.26 46.99,46.99 43.18,46.99 v42.67,46.48
SD_CLK  (via drill 0.38 pad 0.25)
  Top 0.203: U1.P$53 46.84,36.35 47.5,35.69 47.5,33.53 45.97,32 v45.97,31.75
  Bottom 0.203: X1.P$5 40.64,6.48 42.04,7.87 42.04,9.78 40.64,11.18 40.64,19.05 41.91,20.32 44.7,20.32 46.61,22.23 46.61,26.67 44.45,28.83 44.45,31.24 44.96,31.75 v45.97,31.75
SD_CMD  (via drill 0.38 pad 0.25)
  Top 0.203: v39.37,33.91 39.37,34.04 38.73,34.67 38.73,36.07 38.1,36.7 38.1,37.97 39.5,39.37 42.55,39.37 43.31,38.61 43.31,37.72 44.18,36.85 U1.P$54
  Bottom 0.203: X1.P$3 38.44,7.28 35.31,10.41 35.31,25.15 37.85,27.69 37.85,32.38 v39.37,33.91
SD_DAT0  (via drill 0.38 pad 0.25)
  Top 0.203: U1.P$39 38.62,31 37.85,30.23 37.85,26.8 39.5,25.15 44.32,25.15 45.85,23.62 45.85,21.72 45.21,21.08 v45.21,18.92
  Bottom 0.203: X1.P$7 42.84,11.09 44.2,12.45 arc90 44.2,12.86 43.75,13.32 arc-90 43.75,13.73 43.91,13.9 arc-90 44.33,13.9 45.65,12.58 arc90 46.06,12.58 46.23,12.74 arc90 46.23,13.16 44.91,14.48 arc-90 44.91,14.89 45.08,15.06 arc-90 45.49,15.06 45.94,14.61 arc90 46.35,14.61 46.61,14.86 46.61,17.53 v45.21,18.92
SD_DAT1  (via drill 0.38 pad 0.25)
  Top 0.203: U1.P$40 39.12,30.73 38.35,29.97 38.35,26.92 39.12,26.16 39.37,25.91 39.75,25.53 44.58,25.53 46.35,23.75 46.35,20.57 v45.85,20.07
  Bottom 0.203: X1.P$8 43.94,7.62 44.2,7.88 arc90 44.2,8.29 43.84,8.64 arc-90 43.84,9.05 43.9,9.11 arc-90 44.31,9.11 45.43,7.99 arc90 45.84,7.99 45.9,8.05 arc90 45.9,8.46 44.78,9.58 arc-90 44.78,9.99 44.84,10.05 arc-90 45.25,10.05 45.6,9.7 arc90 46.02,9.7 47.12,10.8 47.12,18.8 v45.85,20.07
SD_DAT2  (via drill 0.38 pad 0.25)
  Top 0.203: U1.P$51 44.02,35.35 43.31,36.07 43.31,36.7 42.55,37.47 42.55,37.97 41.91,38.61 39.88,38.61 39.37,38.1 39.37,36.83 39.75,36.45 v39.75,35.94
  Bottom 0.203: X1.P$1 36.24,8.21 34.29,10.16 34.29,25.4 36.83,27.94 36.83,33.02 38.35,34.54 38.61,34.54 39.12,35.05 39.12,35.43 39.62,35.94 v39.75,35.94
SD_DAT3  (via drill 0.38 pad 0.25)
  Top 0.203: U1.P$52 44.03,35.85 43.69,36.2 43.69,36.83 42.93,37.59 42.93,38.35 42.29,38.99 39.75,38.99 38.86,38.1 38.86,36.45 39.12,36.2 39.12,35.43 v39.75,34.8
  Bottom 0.203: X1.P$2 37.34,7.75 34.8,10.29 34.8,25.27 37.34,27.81 37.34,32.77 39.12,34.54 39.5,34.54 v39.75,34.8
SWCLK  (via drill 0.38 pad 0.25)
  Top 0.203: v52.7,30.73 51.82,30.73 49.91,28.83 49.91,27.56 50.55,26.92 51.56,26.92 51.69,27.05 53.72,27.05 54.1,26.67 69.85,26.67 71.5,25.02 71.5,19.81 70.74,19.05 69.47,19.05 68.58,19.94 DBG1.P$13 68.45,20.95 | v51.94,34.8 v49.78,32.64 | U1.P$49 46.8,34.35 v46.86,34.29
  Bottom 0.203: v52.7,30.73 52.32,31.11 52.32,34.42 v51.94,34.8 | v46.86,34.29 47.24,34.29 48.9,32.64 v49.78,32.64
SWDIO  (via drill 0.38 pad 0.25)
  Top 0.203: U1.P$46 42.12,30.69 41.66,30.23 41.66,27.43 42.16,26.92 44.07,26.92 44.2,27.05 46.48,27.05 48.39,25.15 49.02,25.15 49.78,25.91 50.55,25.91 v51.56,24.89 | v52.32,26.42 54.61,24.13 v58.42,24.13 | DBG1.P$11 67.31,19.81 v68.07,19.05
  Bottom 0.203: v58.42,24.13 62.23,24.13 65.66,20.7 65.66,19.05 66.29,18.41 67.44,18.41 v68.07,19.05 | v51.56,24.89 51.56,25.65 v52.32,26.42
USB_D_N
  Top 0.203: USB1.P$2 36.69,6.42 46.71,16.45 46.71,23.94 44.77,25.88 41.09,25.88 40.23,26.73 40.23,28.38 40.62,28.77 40.62,30.32 41.12,30.83 U1.P$44
USB_D_P
  Top 0.203: USB1.P$3 37.34,6.39 47.14,16.19 47.14,24.19 45.02,26.31 41.34,26.31 40.66,26.99 40.66,28.13 41.05,28.51 41.05,30.25 41.62,30.83 U1.P$45
USB_ID  (via drill 0.38 pad 0.25)
  Top 0.203: USB1.P$4 37.99,6.24 47.62,15.88 47.62,24.77 v45.97,26.42 | v40.64,33.91 40.64,32.22 U1.P$43
  Bottom 0.203: v45.97,26.42 40.64,31.75 v40.64,33.91
USB_OVP  (via drill 0.38, 0.38 pad 0.25)
  Top 0.203: v36.32,18.29 32.26,18.29 29.97,16 29.97,12.57 30.48,12.06 U6.P$2 33.27,12.06 33.53,11.81 33.53,8.64 33.23,8.34 R16.1 | U1.P$56 46.86,37.85 47.24,37.47 47.24,36.58 47.88,35.94 47.88,34.67 v48.77,33.78
  Bottom 0.203: v36.32,18.29 38.1,20.07 38.1,25.4 38.35,25.65 38.35,31.88 40.01,33.53 40.01,34.16 40.39,34.54 40.39,35.05 40.77,35.43 41.27,35.43 41.78,34.92 47.62,34.92 v48.77,33.78
USB_VBUS  (via drill 0.38 pad 0.25)
  Top 0.305: C19.1 35.18,6.35 | v39.5,27.94 39.5,28.45 40.12,29.07 U1.P$42 | 39.12,10.79 39.61,11.29 C18.1 39.61,16.52 v38.61,17.53
  Top 0.356: USB1.P$1 36.04,5.45 C19.1 | U6.P$8 C18.1 | U6.P$6 39.12,10.79 39.12,9.53 37.21,7.62 36.45,7.62 35.18,6.35
  Bottom 0.305: v38.61,17.53 38.61,18.29 41.27,20.95 44.58,20.95 45.85,22.23 45.85,24.13 44.7,25.27 41.66,25.27 39.5,27.43 v39.5,27.94
USB_VBUSEN  (via drill 0.38 pad 0.25)
  Top 0.203: v36.32,17.14 32,17.14 30.48,15.62 30.48,13.59 30.73,13.34 U6.P$1 | U1.P$41 39.62,29.84 v38.99,29.21
  Bottom 0.203: v36.32,17.14 36.45,17.14 40.64,21.34 40.64,24.13 38.86,25.91 38.86,29.08 v38.99,29.21

### Text on the board
Bottom: v1 revD 25 Nov 2014
tPlace: Reset | RSSI | - | BOOT0 | + | Button0 | 6V-18V | GND | Button1
bPlace: SCL | SDA | GND | GND | DAC0 | GND | DAC1 | GND | Pioneers in Engineering | Robot Controller | Rev. B "Kanade" | Serial# | GND | ADC0 | ADC1 | GND | ADC2 | 5V | GND | ADC3 | TX+ | TX- | GND | RX- | RX+ | GND | 5V | GND | CLK | MISO | MOSI | (c) Pioneers in Engineering. / Design by: Robert Ou. / This design is open source / hardware. / For more information, visit / pioneers.berkeley.edu/opensource. | MicroSD